# EAGLE design cd32_breakout_1.1a (EAGLE 7.7.0)
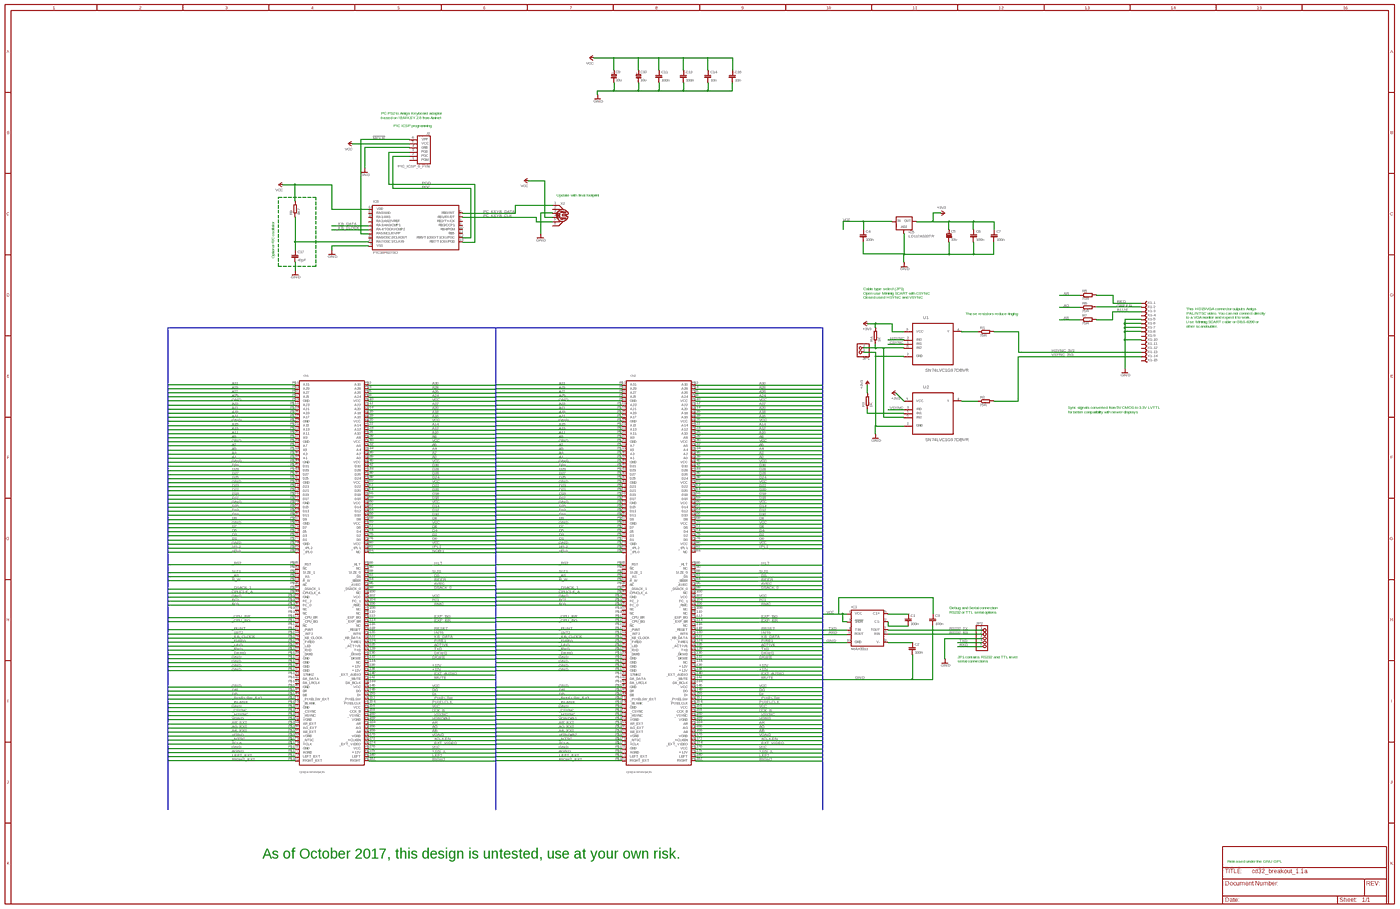
[diagram p0: schematic, sheet 1, overview]
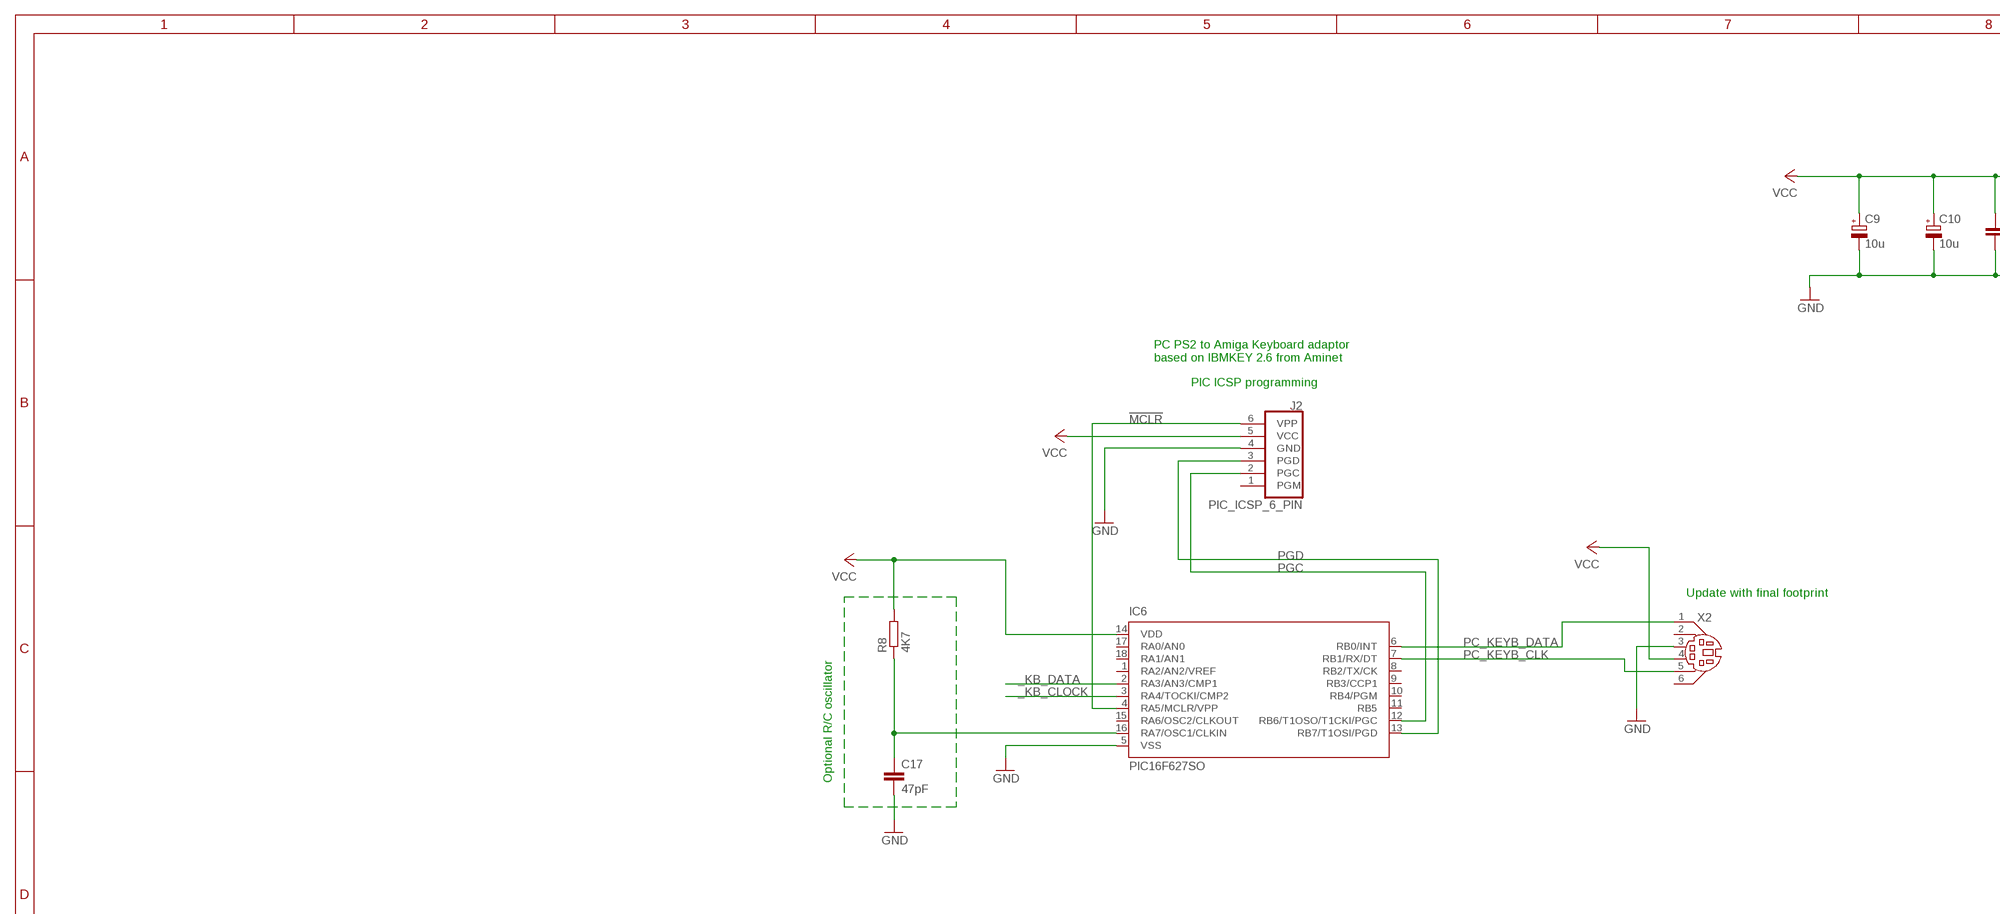
[diagram p1: schematic, sheet 1, part 1 of 4]
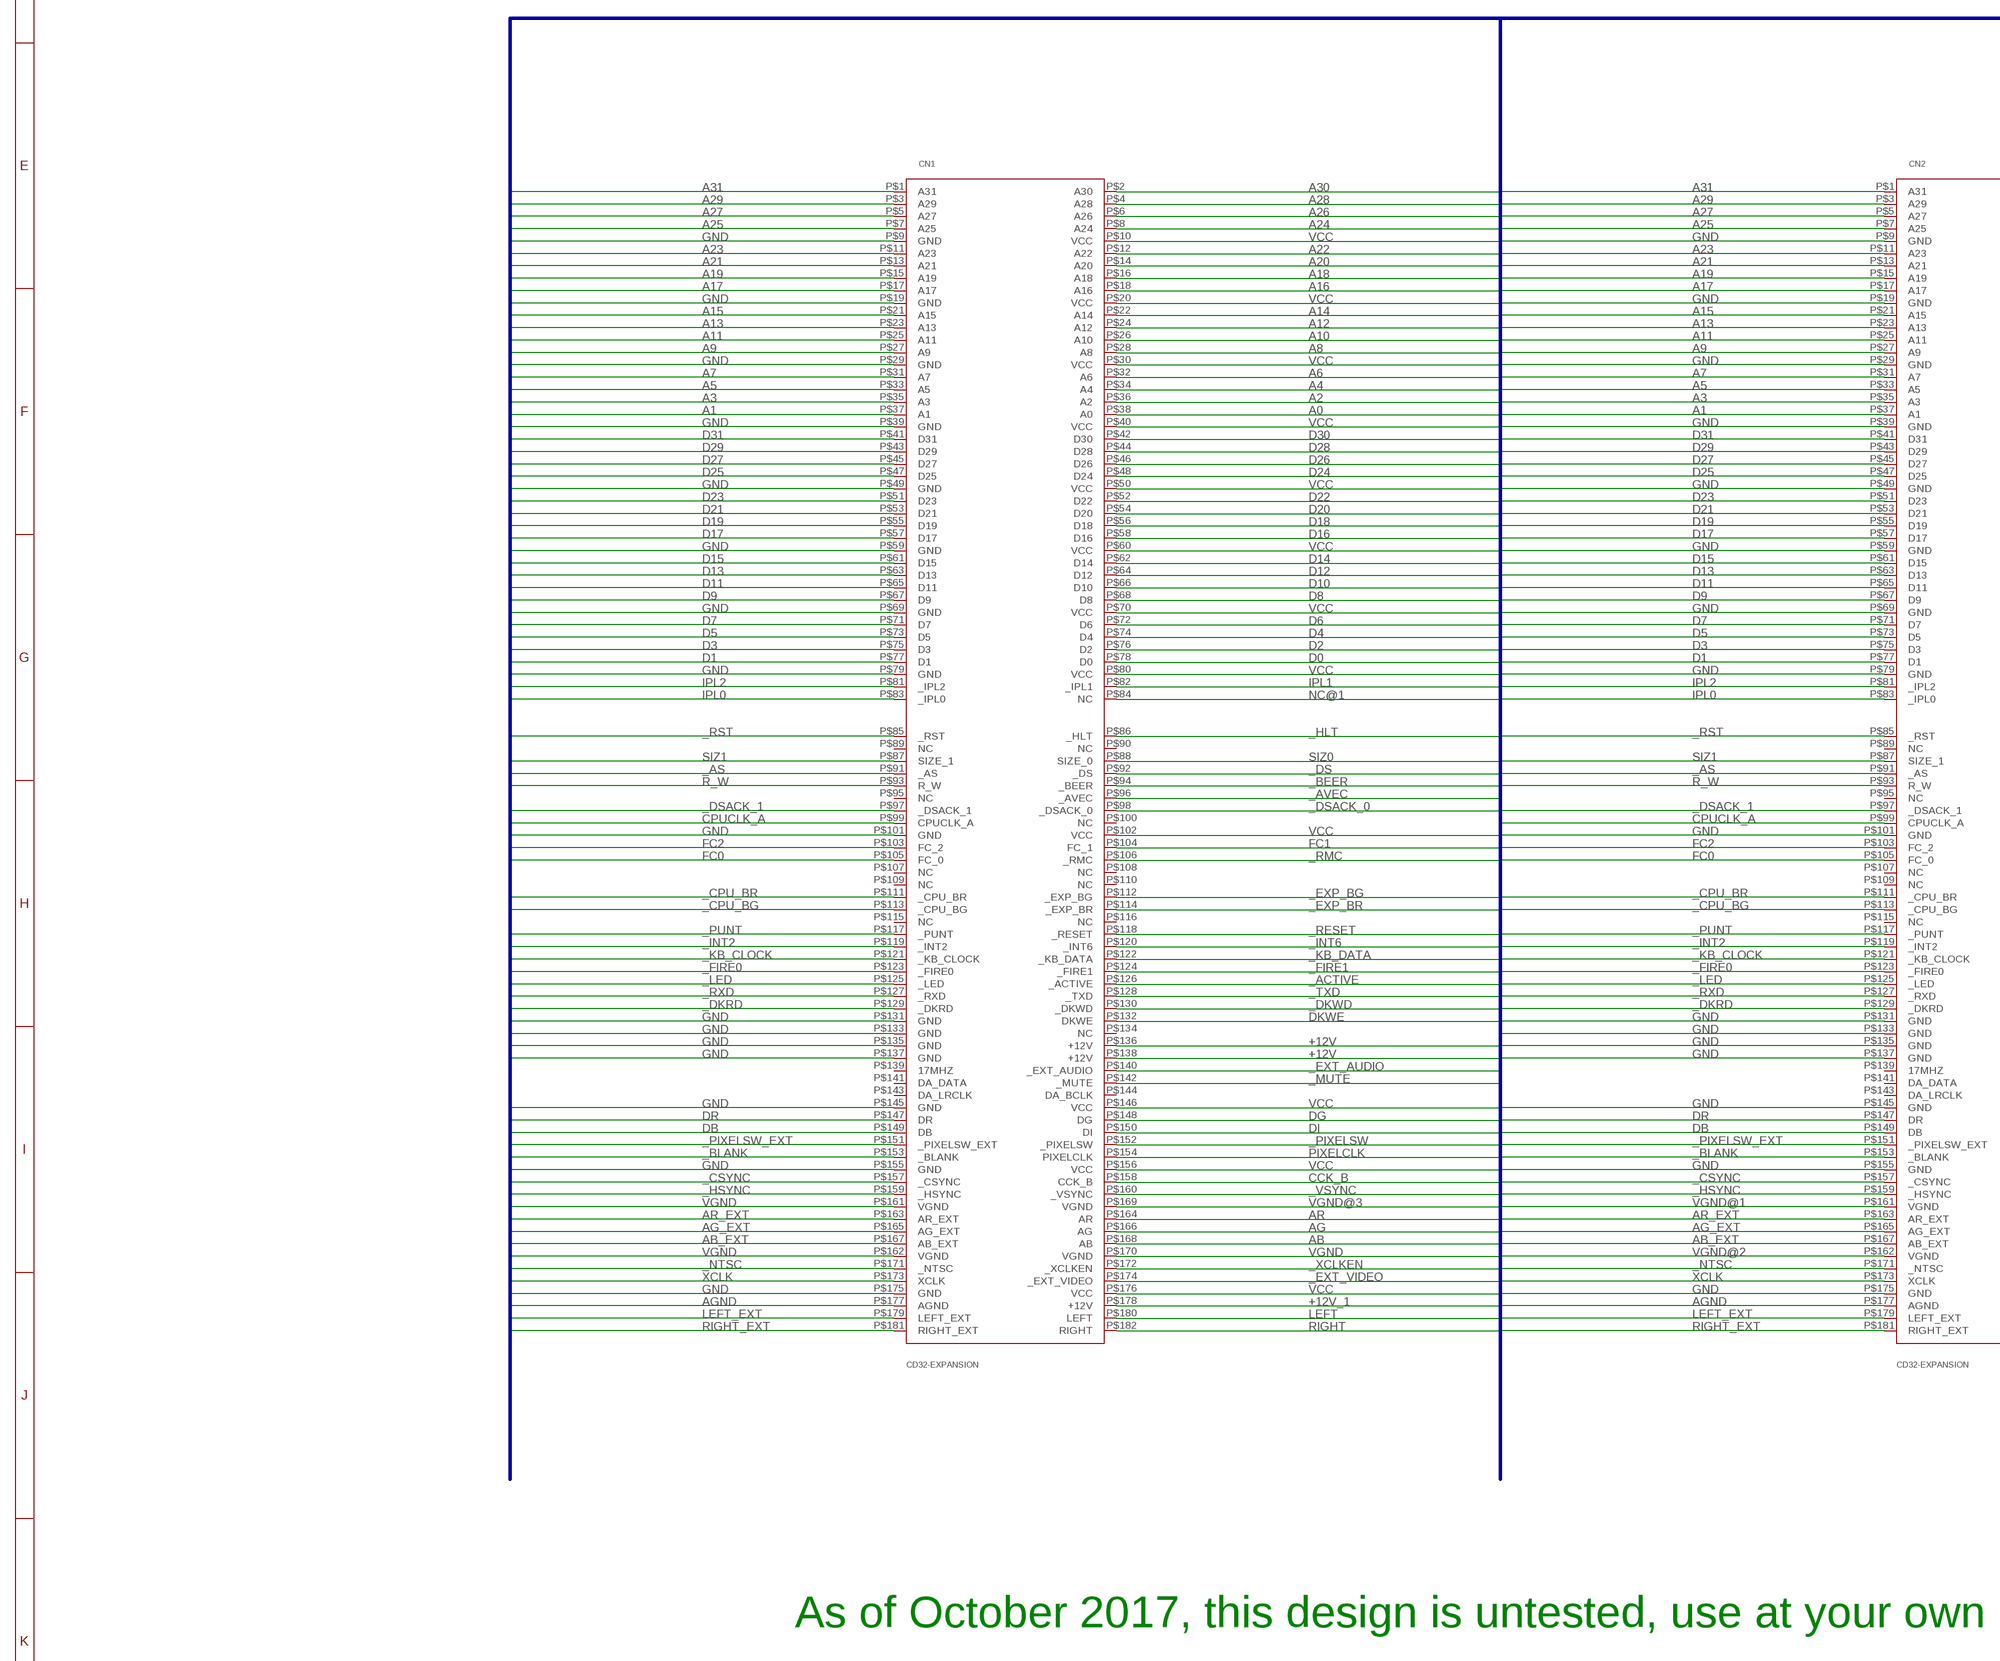
[diagram p2: schematic, sheet 1, part 2 of 4]
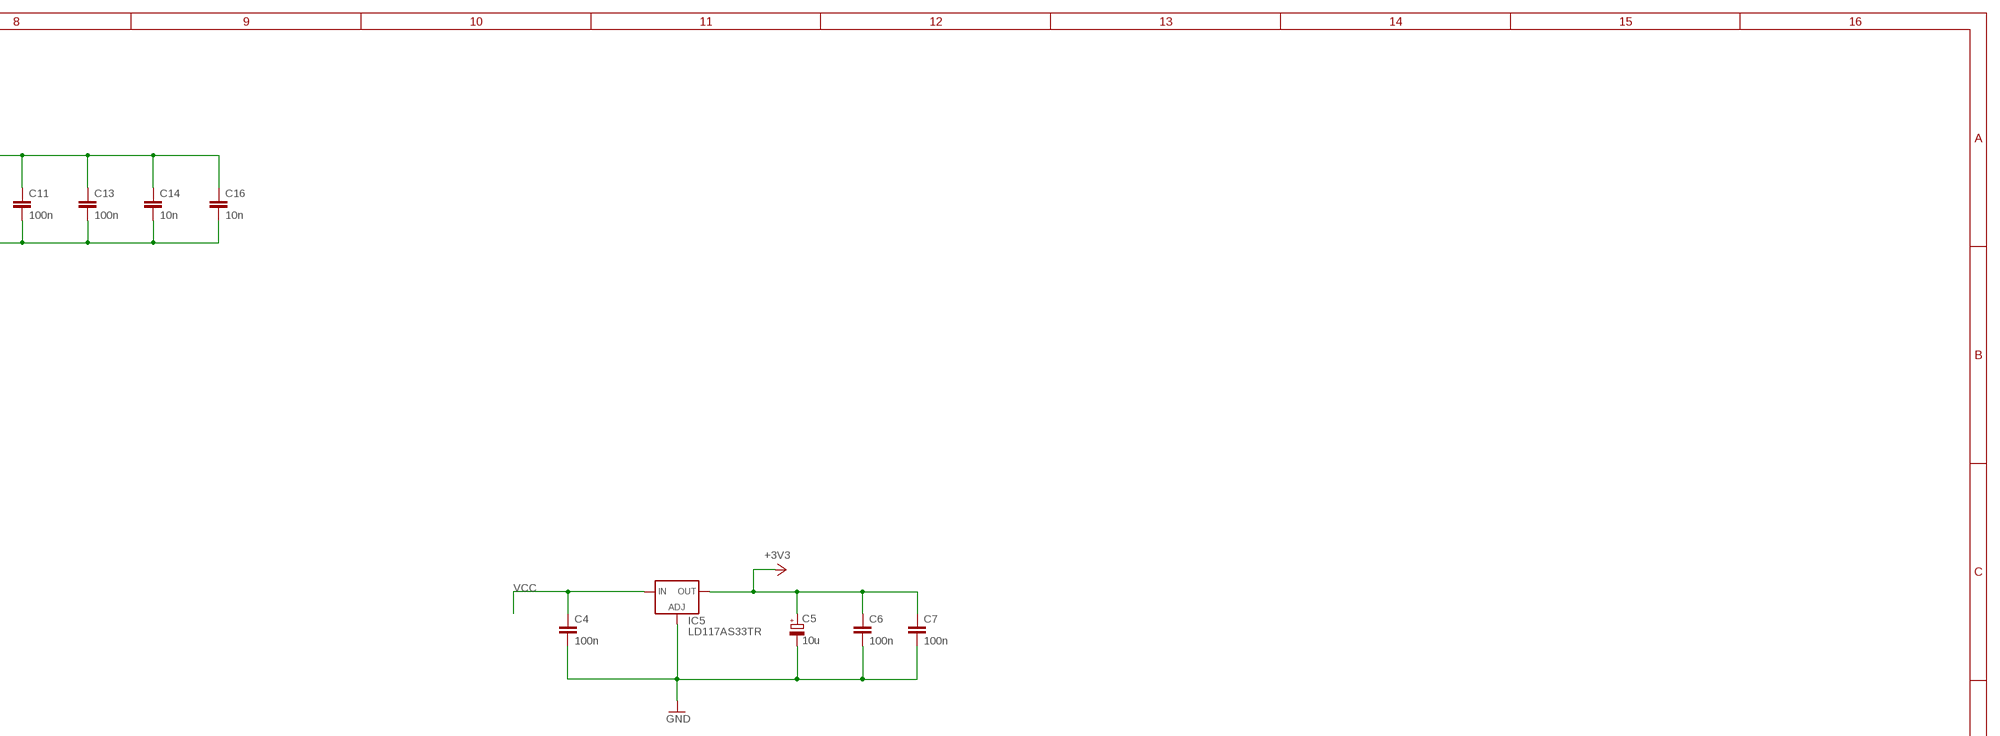
[diagram p3: schematic, sheet 1, part 3 of 4]
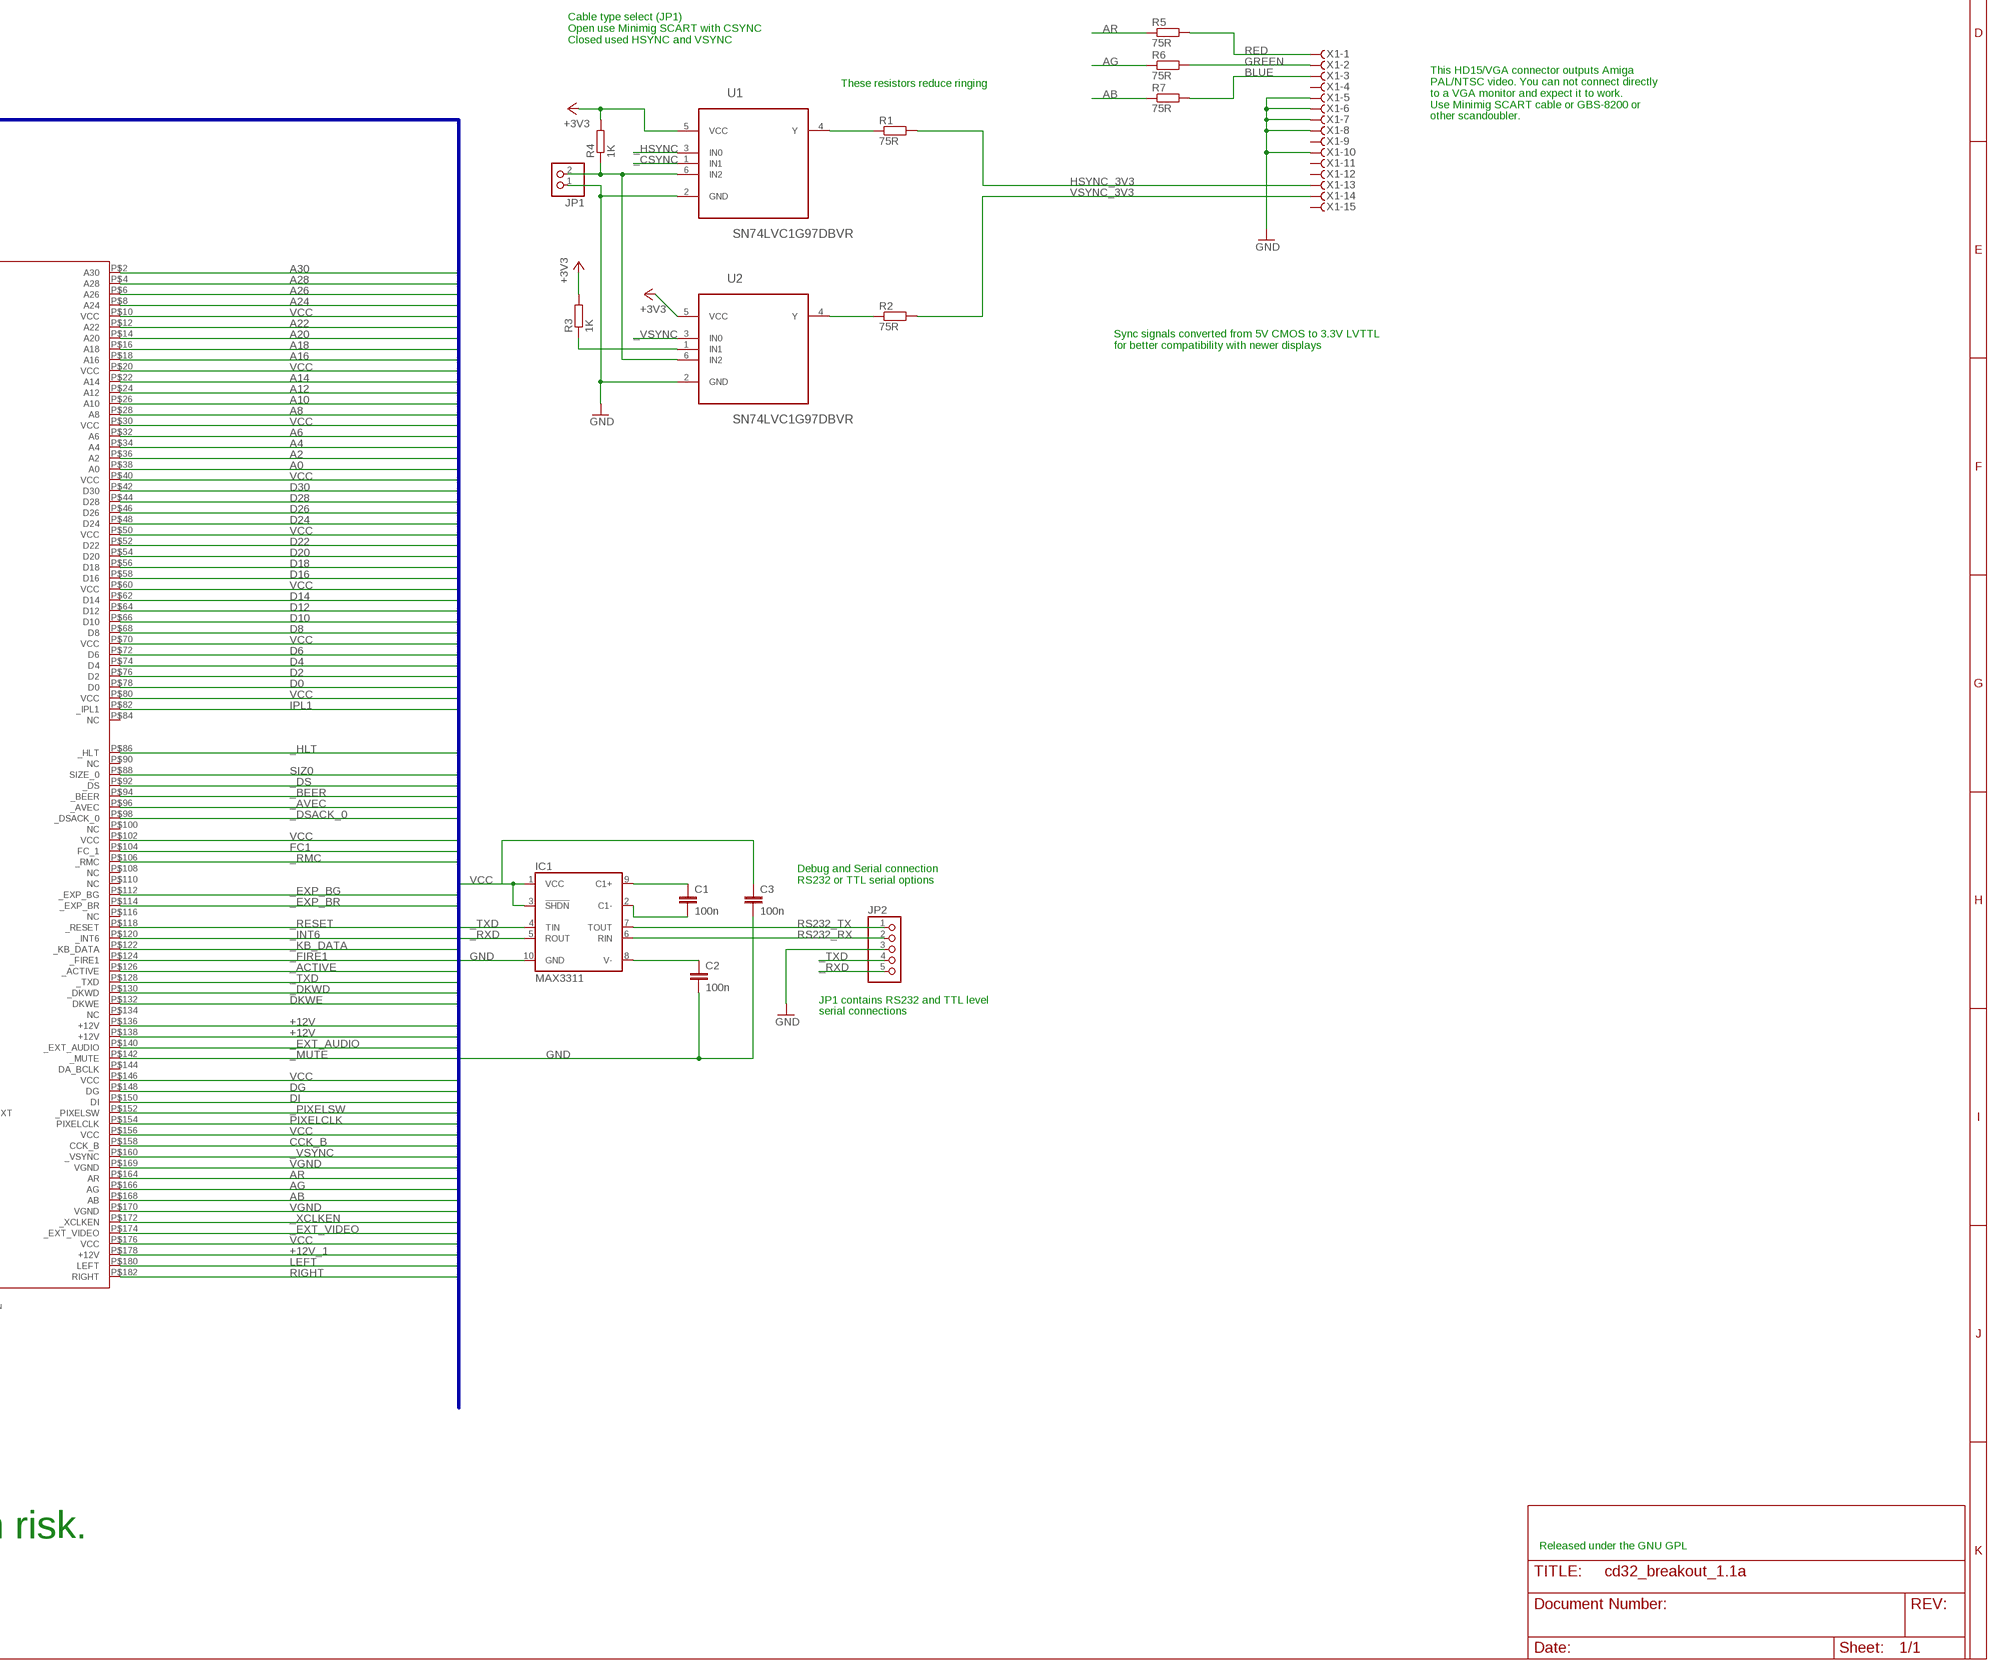
[diagram p4: schematic, sheet 1, part 4 of 4]

## Parts
C1  100n  CC0603  [C0603]
C2  100n  CC0603  [C0603]
C3  100n  CC0603  [C0603]
C4  100n  C-EUC0603  [C0603]
C5  10u  CPOL-EUC  [PANASONIC_C]
C6  100n  C-EUC0603  [C0603]
C7  100n  C-EUC0603  [C0603]
C9  10u  CPOL-EUC  [PANASONIC_C]
C10  10u  CPOL-EUC  [PANASONIC_C]
C11  100n  C-EUC0603  [C0603]
C13  100n  C-EUC0603  [C0603]
C14  10n  C-EUC0603  [C0603]
C16  10n  C-EUC0603  [C0603]
C17  47pF  C-EUC0603  [C0603]
CN1  CD32-EXPANSION  [CD32_EXPANSION_182_MCA]
CN2  CD32-EXPANSION  [CD32_EXPANSION_182_MCA]
IC1  MAX3311  [UMAX10]
IC5  LD117AS33TR  [SOT223]
IC6  PIC16F627SO  [SO-18W]
J2  PIC_ICSP_6_PIN  [MOLEX-1X6]
JP1  PINHD-1X2  [1X02]
JP2  PINHD-1X5  [1X05]
R1  75R  R-EU_R0603  [R0603]
R2  75R  R-EU_R0603  [R0603]
R3  1K  R-EU_R0603  [R0603]
R4  1K  R-EU_R0603  [R0603]
R5  75R  R-EU_R0603  [R0603]
R6  75R  R-EU_R0603  [R0603]
R7  75R  R-EU_R0603  [R0603]
R8  4K7  R-EU_R0603  [R0603]
U1  SN74LVC1G97DBVR  [SOT95P280X145-6N]
U2  SN74LVC1G97DBVR  [SOT95P280X145-6N]
X1  F15HDVS  [HDF15V]
X2  MDIN06K  [MDIN06K]

## Nets
!MCLR: IC6.4(RA5/MCLR/VPP) J2.6(VPP)
+3V3: C5.+ C6.1 C7.1 IC5.4(OUT) R3.2 R4.2 U1.5(VCC) U2.5(VCC)
+12V: CN1.P$136(+12V) CN1.P$138(+12V) CN2.P$136(+12V) CN2.P$138(+12V)
+12V_1: CN1.P$178(+12V) CN2.P$178(+12V)
_ACTIVE: CN1.P$126(_ACTIVE) CN2.P$126(_ACTIVE)
_AS: CN1.P$91(_AS) CN2.P$91(_AS)
_AVEC: CN1.P$96(_AVEC) CN2.P$96(_AVEC)
_BEER: CN1.P$94(_BEER) CN2.P$94(_BEER)
_BLANK: CN1.P$153(_BLANK) CN2.P$153(_BLANK)
_CPU_BG: CN1.P$113(_CPU_BG) CN2.P$113(_CPU_BG)
_CPU_BR: CN1.P$111(_CPU_BR) CN2.P$111(_CPU_BR)
_CSYNC: CN1.P$157(_CSYNC) CN2.P$157(_CSYNC) U1.1(IN1)
_DKRD: CN1.P$129(_DKRD) CN2.P$129(_DKRD)
_DKWD: CN1.P$130(_DKWD) CN2.P$130(_DKWD)
_DS: CN1.P$92(_DS) CN2.P$92(_DS)
_DSACK_0: CN1.P$98(_DSACK_0) CN2.P$98(_DSACK_0)
_DSACK_1: CN1.P$97(_DSACK_1) CN2.P$97(_DSACK_1)
_EXP_BG: CN1.P$112(_EXP_BG) CN2.P$112(_EXP_BG)
_EXP_BR: CN1.P$114(_EXP_BR) CN2.P$114(_EXP_BR)
_EXT_AUDIO: CN1.P$140(_EXT_AUDIO) CN2.P$140(_EXT_AUDIO)
_EXT_VIDEO: CN1.P$174(_EXT_VIDEO) CN2.P$174(_EXT_VIDEO)
_FIRE0: CN1.P$123(_FIRE0) CN2.P$123(_FIRE0)
_FIRE1: CN1.P$124(_FIRE1) CN2.P$124(_FIRE1)
_HLT: CN1.P$86(_HLT) CN2.P$86(_HLT)
_HSYNC: CN1.P$159(_HSYNC) CN2.P$159(_HSYNC) U1.3(IN0)
_INT2: CN1.P$119(_INT2) CN2.P$119(_INT2)
_INT6: CN1.P$120(_INT6) CN2.P$120(_INT6)
_KB_CLOCK: CN1.P$121(_KB_CLOCK) CN2.P$121(_KB_CLOCK) IC6.3(RA4/TOCKI/CMP2)
_KB_DATA: CN1.P$122(_KB_DATA) CN2.P$122(_KB_DATA) IC6.2(RA3/AN3/CMP1)
_LED: CN1.P$125(_LED) CN2.P$125(_LED)
_MUTE: CN1.P$142(_MUTE) CN2.P$142(_MUTE)
_NTSC: CN1.P$171(_NTSC) CN2.P$171(_NTSC)
_PIXELSW: CN1.P$152(_PIXELSW) CN2.P$152(_PIXELSW)
_PIXELSW_EXT: CN1.P$151(_PIXELSW_EXT) CN2.P$151(_PIXELSW_EXT)
_PUNT: CN1.P$117(_PUNT) CN2.P$117(_PUNT)
_RESET: CN1.P$118(_RESET) CN2.P$118(_RESET)
_RMC: CN1.P$106(_RMC) CN2.P$106(_RMC)
_RST: CN1.P$85(_RST) CN2.P$85(_RST)
_RXD: CN1.P$127(_RXD) CN2.P$127(_RXD) IC1.5(ROUT) JP2.5
_TXD: CN1.P$128(_TXD) CN2.P$128(_TXD) IC1.4(TIN) JP2.4
_VSYNC: CN1.P$160(_VSYNC) CN2.P$160(_VSYNC) U2.3(IN0)
_XCLKEN: CN1.P$172(_XCLKEN) CN2.P$172(_XCLKEN)
A0: CN1.P$38(A0) CN2.P$38(A0)
A1: CN1.P$37(A1) CN2.P$37(A1)
A2: CN1.P$36(A2) CN2.P$36(A2)
A3: CN1.P$35(A3) CN2.P$35(A3)
A4: CN1.P$34(A4) CN2.P$34(A4)
A5: CN1.P$33(A5) CN2.P$33(A5)
A6: CN1.P$32(A6) CN2.P$32(A6)
A7: CN1.P$31(A7) CN2.P$31(A7)
A8: CN1.P$28(A8) CN2.P$28(A8)
A9: CN1.P$27(A9) CN2.P$27(A9)
A10: CN1.P$26(A10) CN2.P$26(A10)
A11: CN1.P$25(A11) CN2.P$25(A11)
A12: CN1.P$24(A12) CN2.P$24(A12)
A13: CN1.P$23(A13) CN2.P$23(A13)
A14: CN1.P$22(A14) CN2.P$22(A14)
A15: CN1.P$21(A15) CN2.P$21(A15)
A16: CN1.P$18(A16) CN2.P$18(A16)
A17: CN1.P$17(A17) CN2.P$17(A17)
A18: CN1.P$16(A18) CN2.P$16(A18)
A19: CN1.P$15(A19) CN2.P$15(A19)
A20: CN1.P$14(A20) CN2.P$14(A20)
A21: CN1.P$13(A21) CN2.P$13(A21)
A22: CN1.P$12(A22) CN2.P$12(A22)
A23: CN1.P$11(A23) CN2.P$11(A23)
A24: CN1.P$8(A24) CN2.P$8(A24)
A25: CN1.P$7(A25) CN2.P$7(A25)
A26: CN1.P$6(A26) CN2.P$6(A26)
A27: CN1.P$5(A27) CN2.P$5(A27)
A28: CN1.P$4(A28) CN2.P$4(A28)
A29: CN1.P$3(A29) CN2.P$3(A29)
A30: CN1.P$2(A30) CN2.P$2(A30)
A31: CN1.P$1(A31) CN2.P$1(A31)
AB: CN1.P$168(AB) CN2.P$168(AB) R7.1
AB_EXT: CN1.P$167(AB_EXT) CN2.P$167(AB_EXT)
AG: CN1.P$166(AG) CN2.P$166(AG) R6.1
AG_EXT: CN1.P$165(AG_EXT) CN2.P$165(AG_EXT)
AGND: CN1.P$177(AGND) CN2.P$177(AGND)
AR: CN1.P$164(AR) CN2.P$164(AR) R5.1
AR_EXT: CN1.P$163(AR_EXT) CN2.P$163(AR_EXT)
BLUE: R7.2 X1.3
CCK_B: CN1.P$158(CCK_B) CN2.P$158(CCK_B)
CPUCLK_A: CN1.P$99(CPUCLK_A) CN2.P$99(CPUCLK_A)
D0: CN1.P$78(D0) CN2.P$78(D0)
D1: CN1.P$77(D1) CN2.P$77(D1)
D2: CN1.P$76(D2) CN2.P$76(D2)
D3: CN1.P$75(D3) CN2.P$75(D3)
D4: CN1.P$74(D4) CN2.P$74(D4)
D5: CN1.P$73(D5) CN2.P$73(D5)
D6: CN1.P$72(D6) CN2.P$72(D6)
D7: CN1.P$71(D7) CN2.P$71(D7)
D8: CN1.P$68(D8) CN2.P$68(D8)
D9: CN1.P$67(D9) CN2.P$67(D9)
D10: CN1.P$66(D10) CN2.P$66(D10)
D11: CN1.P$65(D11) CN2.P$65(D11)
D12: CN1.P$64(D12) CN2.P$64(D12)
D13: CN1.P$63(D13) CN2.P$63(D13)
D14: CN1.P$62(D14) CN2.P$62(D14)
D15: CN1.P$61(D15) CN2.P$61(D15)
D16: CN1.P$58(D16) CN2.P$58(D16)
D17: CN1.P$57(D17) CN2.P$57(D17)
D18: CN1.P$56(D18) CN2.P$56(D18)
D19: CN1.P$55(D19) CN2.P$55(D19)
D20: CN1.P$54(D20) CN2.P$54(D20)
D21: CN1.P$53(D21) CN2.P$53(D21)
D22: CN1.P$52(D22) CN2.P$52(D22)
D23: CN1.P$51(D23) CN2.P$51(D23)
D24: CN1.P$48(D24) CN2.P$48(D24)
D25: CN1.P$47(D25) CN2.P$47(D25)
D26: CN1.P$46(D26) CN2.P$46(D26)
D27: CN1.P$45(D27) CN2.P$45(D27)
D28: CN1.P$44(D28) CN2.P$44(D28)
D29: CN1.P$43(D29) CN2.P$43(D29)
D30: CN1.P$42(D30) CN2.P$42(D30)
D31: CN1.P$41(D31) CN2.P$41(D31)
DB: CN1.P$149(DB) CN2.P$149(DB)
DG: CN1.P$148(DG) CN2.P$148(DG)
DI: CN1.P$150(DI) CN2.P$150(DI)
DKWE: CN1.P$132(DKWE) CN2.P$132(DKWE)
DR: CN1.P$147(DR) CN2.P$147(DR)
FC0: CN1.P$105(FC_0) CN2.P$105(FC_0)
FC1: CN1.P$104(FC_1) CN2.P$104(FC_1)
FC2: CN1.P$103(FC_2) CN2.P$103(FC_2)
GND: C2.2 C3.2 C4.2 C5.- C6.2 C7.2 C9.- C10.- C11.2 C13.2 C14.2 C16.2 C17.2 CN1.P$9(GND) CN1.P$19(GND) CN1.P$29(GND) CN1.P$39(GND) CN1.P$49(GND) CN1.P$59(GND) CN1.P$69(GND) CN1.P$79(GND) CN1.P$101(GND) CN1.P$131(GND) CN1.P$133(GND) CN1.P$135(GND) CN1.P$137(GND) CN1.P$145(GND) CN1.P$155(GND) CN1.P$175(GND) CN2.P$9(GND) CN2.P$19(GND) CN2.P$29(GND) CN2.P$39(GND) CN2.P$49(GND) CN2.P$59(GND) CN2.P$69(GND) CN2.P$79(GND) CN2.P$101(GND) CN2.P$131(GND) CN2.P$133(GND) CN2.P$135(GND) CN2.P$137(GND) CN2.P$145(GND) CN2.P$155(GND) CN2.P$175(GND) IC1.10(GND) IC5.1(ADJ) IC6.5(VSS) J2.4(GND) JP1.1 JP2.3 U1.2(GND) U2.2(GND) X1.5 X1.6 X1.7 X1.8 X1.10 X2.3
GREEN: R6.2 X1.2
HSYNC_3V3: R1.2 X1.13
IPL0: CN1.P$83(_IPL0) CN2.P$83(_IPL0)
IPL1: CN1.P$82(_IPL1) CN2.P$82(_IPL1)
IPL2: CN1.P$81(_IPL2) CN2.P$81(_IPL2)
LEFT: CN1.P$180(LEFT) CN2.P$180(LEFT)
LEFT_EXT: CN1.P$179(LEFT_EXT) CN2.P$179(LEFT_EXT)
N$1: C1.1 IC1.9(C1+)
N$2: C1.2 IC1.2(C1-)
N$3: C2.1 IC1.8(V-)
N$6: R3.1 U2.1(IN1)
N$7: JP1.2 R4.1 U1.6(IN2) U2.6(IN2)
N$8: R1.1 U1.4(Y)
N$9: R2.1 U2.4(Y)
N$10: C17.1 IC6.16(RA7/OSC1/CLKIN) R8.1
NC@1: CN1.P$84(NC)
PC_KEYB_CLK: IC6.7(RB1/RX/DT) X2.5
PC_KEYB_DATA: IC6.6(RB0/INT) X2.1
PGC: IC6.12(RB6/T1OSO/T1CKI/PGC) J2.2(PGC)
PGD: IC6.13(RB7/T1OSI/PGD) J2.3(PGD)
PIXELCLK: CN1.P$154(PIXELCLK) CN2.P$154(PIXELCLK)
R_W: CN1.P$93(R_W) CN2.P$93(R_W)
RED: R5.2 X1.1
RIGHT: CN1.P$182(RIGHT) CN2.P$182(RIGHT)
RIGHT_EXT: CN1.P$181(RIGHT_EXT) CN2.P$181(RIGHT_EXT)
RS232_RX: IC1.6(RIN) JP2.2
RS232_TX: IC1.7(TOUT) JP2.1
SIZ0: CN1.P$88(SIZE_0) CN2.P$88(SIZE_0)
SIZ1: CN1.P$87(SIZE_1) CN2.P$87(SIZE_1)
VCC: C3.1 C4.1 C9.+ C10.+ C11.1 C13.1 C14.1 C16.1 CN1.P$10(VCC) CN1.P$20(VCC) CN1.P$30(VCC) CN1.P$40(VCC) CN1.P$50(VCC) CN1.P$60(VCC) CN1.P$70(VCC) CN1.P$80(VCC) CN1.P$102(VCC) CN1.P$146(VCC) CN1.P$156(VCC) CN1.P$176(VCC) CN2.P$10(VCC) CN2.P$20(VCC) CN2.P$30(VCC) CN2.P$40(VCC) CN2.P$50(VCC) CN2.P$60(VCC) CN2.P$70(VCC) CN2.P$80(VCC) CN2.P$102(VCC) CN2.P$146(VCC) CN2.P$156(VCC) CN2.P$176(VCC) IC1.1(VCC) IC1.3(!SHDN) IC5.3(IN) IC6.14(VDD) J2.5(VCC) R8.2 X2.4
VGND: CN1.P$161(VGND) CN1.P$162(VGND) CN1.P$170(VGND) CN2.P$169(VGND) CN2.P$170(VGND)
VGND@1: CN2.P$161(VGND)
VGND@2: CN2.P$162(VGND)
VGND@3: CN1.P$169(VGND)
VSYNC_3V3: R2.2 X1.14
XCLK: CN1.P$173(XCLK) CN2.P$173(XCLK)
Unconnected: CN1.P$89(NC) CN1.P$90(NC) CN1.P$95(NC) CN1.P$100(NC) CN1.P$107(NC) CN1.P$108(NC) CN1.P$109(NC) CN1.P$110(NC) CN1.P$115(NC) CN1.P$116(NC) CN1.P$134(NC) CN1.P$139(17MHZ) CN1.P$141(DA_DATA) CN1.P$143(DA_LRCLK) CN1.P$144(DA_BCLK) CN2.P$84(NC) CN2.P$89(NC) CN2.P$90(NC) CN2.P$95(NC) CN2.P$100(NC) CN2.P$107(NC) CN2.P$108(NC) CN2.P$109(NC) CN2.P$110(NC) CN2.P$115(NC) CN2.P$116(NC) CN2.P$134(NC) CN2.P$139(17MHZ) CN2.P$141(DA_DATA) CN2.P$143(DA_LRCLK) CN2.P$144(DA_BCLK) IC6.1(RA2/AN2/VREF) IC6.8(RB2/TX/CK) IC6.9(RB3/CCP1) IC6.10(RB4/PGM) IC6.11(RB5) IC6.15(RA6/OSC2/CLKOUT) IC6.17(RA0/AN0) IC6.18(RA1/AN1) J2.1(PGM) X1.4 X1.9 X1.11 X1.12 X1.15 X2.2 X2.6

## Buses
A[0..31],AB,AB_EXT,_ACTIVE,AG,AG_EXT,AGND,AR,AR_EXT,_AS,_AVEC,_BEER,_BLANK,CCK_B,CLK_17MHZ,_CPU_BG,_CPU_BR,CPUCLK_A,_CSYNC,D[0..31],DA_BCLK,DA_DATA,DA_LRCLK,DB,DG,DI,_DKRD,_DKWD,DKWE,DR,_DS,_DSACK_0,_DSACK_1,_EXP_BG,_EXP_BR,_EXT_AUDIO,_EXT_VIDEO,FC[0..2],_FIRE0,_FIRE1,GND,_HLT,_HSYNC,_INT2,_INT6,_IPL[0..2],_KB_CLOCK,_KB_DATA,_LED,LEFT,LEFT_EXT,_MUTE,NC,_NTSC,PIXELCLK,_PIXELSW,_PIXELSW_EXT,_PUNT,_RESET,RIGHT,RIGHT_EXT,_RMC,_RST,R_W,_RXD,SIZE[0..1],_TXD,VCC,VCC12V,VGND,_VSYNC,XCLK,_XCLKEN

## Notes on the sheet
- PC PS2 to Amiga Keyboard adaptor
  based on IBMKEY 2.6 from Aminet
- PIC ICSP programming
- Update with final footprint
- Optional R/C oscillator
- Cable type select (JP1)
  Open use Minimig SCART with CSYNC
  Closed used HSYNC and VSYNC
- These resistors reduce ringing
- This HD15/VGA connector outputs Amiga
  PAL/NTSC video. You can not connect directly
  to a VGA monitor and expect it to work.
  Use Minimig SCART cable or GBS-8200 or
  other scandoubler.
- Sync signals converted from 5V CMOS to 3.3V LVTTL
  for better compatibility with newer displays
- Debug and Serial connection
  RS232 or TTL serial options
- JP1 contains RS232 and TTL level
- serial connections
- As of October 2017, this design is untested, use at your own risk.
- Released under the GNU GPL

## Library data of the parts
C1-C3 = eagle-ltspice:C: CAPACITOR, European symbol; SPICEMODEL: NONE; SPICEPREFIX: C
C4 C6 C7 C11 C13 C14 C16 C17 = rcl:C-EU: CAPACITOR, European symbol
C5 C9 C10 = rcl:CPOL-EU: POLARIZED CAPACITOR, European symbol
CN1 CN2 = Amiga:CD32-EXPANSION
IC1 = maxim:MAX3311: 460kbps, 1µA Supply Current, RS-232-Compatible Transceivers in µMAX Source: http://www.maxim-ic.com .. MAX3311-MAX3313.pdf; MF: MAXIM; MPN: MAX3311ECUB+; OC_FARNELL: 1379937; OC_NEWARK: 67K4953
IC5 = v-reg:LD117A?*: Low drop fixed and adjustable positive voltage regulators 1 A Source: http://www.st.com/stonline/products/literature/ds/7194/ld1117axx.pdf
IC6 = microchip:PIC16F62*: FLASH-Based 8-Bit CMOS Microcontroller Source: http://ww1.microchip.com/downloads/en/DeviceDoc/40300C.pdf; MF: MICROCHIP; MPN: PIC16F627-04I/SO; OC_FARNELL: 9760296; OC_NEWARK: 19C7271
J2 = SparkFun-Connectors:PIC_ICSP_6_PIN: ISCP Programming connector for PICs This 6 pin header contains all the lines necessary for programming most PIC microcontrollers. Here is the connector we sell at SparkFun: Polarized Connectors - Header (6-Pin) <https://www.sparkfun.com/products/8094> (PRT-08094) It is used on this SparkFun product: SparkFun UDB5 - PIC UAV Development Board <https://www.sparkfun.com/products/11703> (DEV-11703) Also, if you need a nice PIC programmer, please check these out: MPLAB PICkit 3 <https://www.sparkfun.com/products/9973> (PGM-09973); PROD_ID: CONN-08046; SF_ID: PRT-08094
JP1 = pinhead:PINHD-1X2: PIN HEADER
JP2 = pinhead:PINHD-1X5: PIN HEADER
R1-R8 = rcl:R-EU_: RESISTOR, European symbol
U1 U2 = 74LVC1G97:SN74LVC1G97DBVR: CONFIGURABLE MULTIPLE-FUNCTION GATE; MPN: SN74LVC1G97DBVR; OC_FARNELL: 1470837; OC_NEWARK: 32H6375; PACKAGE: SOT-23-6; SUPPLIER: Texas Instruments
X1 = con-subd:F15?S: SUB-D; OC_FARNELL: unknown; OC_NEWARK: unknown
X2 = con-yamaichi:MDIN06K: YAMAICHI CONNECTOR; OC_FARNELL: unknown; OC_NEWARK: unknown

## Board
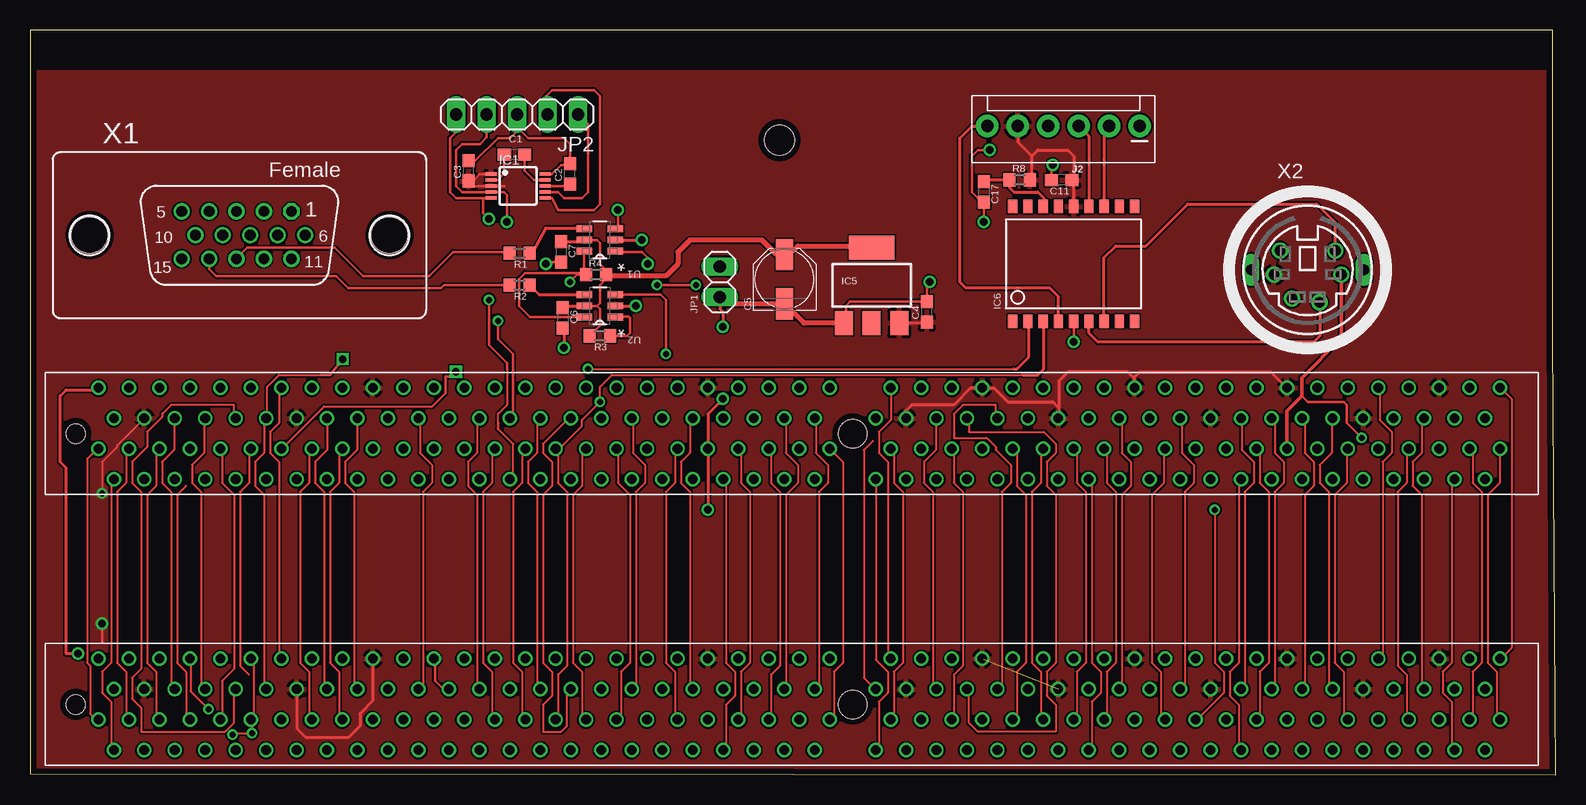
[diagram p5: board, top side]
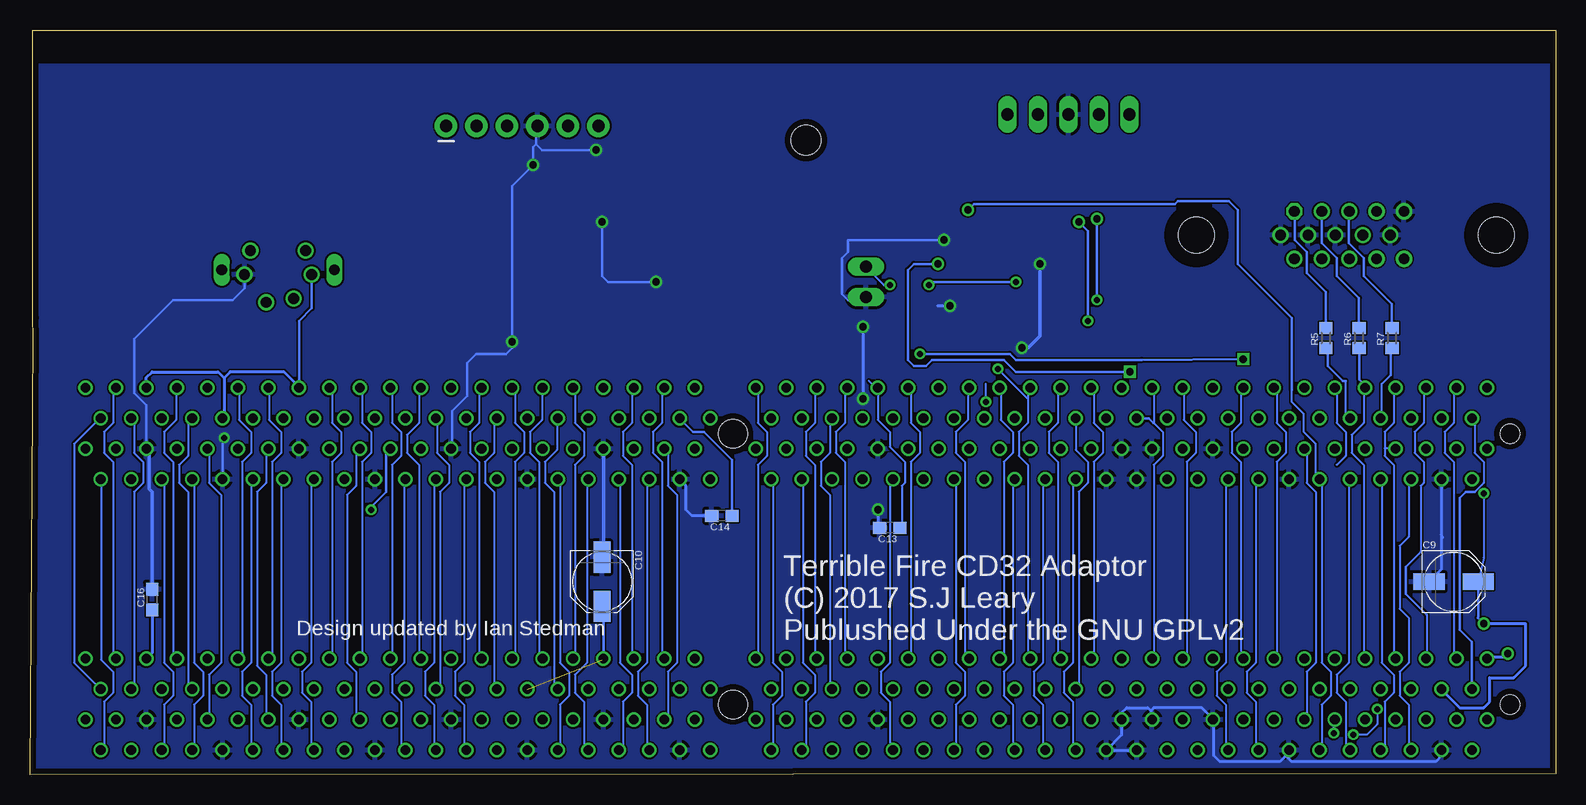
[diagram p6: board, bottom side, seen from below]

Size 127.18 x 62.1 mm. Coordinates in mm from the lower left corner, seen from the top.
Outline: 0,0.1 127.18,0 126.93,36.5 126.95,38.1 126.95,62.1 0,62.1 0,0.1
Copper layers (1*16): Top 0.035mm / dielectric 1.5mm / Bottom 0.035mm
Design rules "pcbtrainsmt": minimum track width 0.15mm, minimum drill 0.5mm, track to track 0.15mm, track to pad 0.15mm, pad to pad 0.15mm, via to via 0.15mm, smd to smd 0.15mm, copper to edge 0.5mm, drill to drill 0.5mm, minimum pad ring 5mil, minimum via ring 8mil, stop-mask expansion 0mil, vias tented up to drill 0mil, thermal gap 10mil
Holes 2.5 mm at 62.49,52.92

### Footprints (pad centres in the part's own frame; a part is rotated, then mirrored left to right if it is on the bottom)
C0603 = smd 1.1 x 1: 1 -0.85,0; 2 0.85,0
PANASONIC_C = smd 2.6 x 1.4: + 2.05,0; - -2.05,0
CD32_EXPANSION_182_MCA = drill 0.8: P$1 59.055,-1.27; P$2 59.055,3.81; P$3 57.785,-3.81; P$4 57.785,1.27; P$5 56.515,-1.27; P$6 56.515,3.81; P$7 55.245,-3.81; P$8 55.245,1.27; P$9 53.975,-1.27; P$10 53.975,3.81; P$11 52.705,-3.81; P$12 52.705,1.27; P$13 51.435,-1.27; P$14 51.435,3.81; P$15 50.165,-3.81; P$16 50.165,1.27; P$17 48.895,-1.27; P$18 48.895,3.81; P$19 47.625,-3.81; P$20 47.625,1.27; P$21 46.355,-1.27; P$22 46.355,3.81; P$23 45.085,-3.81; P$24 45.085,1.27; P$25 43.815,-1.27; P$26 43.815,3.81; P$27 42.545,-3.81; P$28 42.545,1.27; P$29 41.275,-1.27; P$30 41.275,3.81; P$31 40.005,-3.81; P$32 40.005,1.27; P$33 38.735,-1.27; P$34 38.735,3.81; P$35 37.465,-3.81; P$36 37.465,1.27; P$37 36.195,-1.27; P$38 36.195,3.81; P$39 34.925,-3.81; P$40 34.925,1.27; P$41 33.655,-1.27; P$42 33.655,3.81; P$43 32.385,-3.81; P$44 32.385,1.27; P$45 31.115,-1.27; P$46 31.115,3.81; P$47 29.845,-3.81; P$48 29.845,1.27; P$49 28.575,-1.27; P$50 28.575,3.81; P$51 27.305,-3.81; P$52 27.305,1.27; P$53 26.035,-1.27; P$54 26.035,3.81; P$55 24.765,-3.81; P$56 24.765,1.27; P$57 23.495,-1.27; P$58 23.495,3.81; P$59 22.225,-3.81; P$60 22.225,1.27; P$61 20.955,-1.27; P$62 20.955,3.81; P$63 19.685,-3.81; P$64 19.685,1.27; P$65 18.415,-1.27; P$66 18.415,3.81; P$67 17.145,-3.81; P$68 17.145,1.27; P$69 15.875,-1.27; P$70 15.875,3.81; P$71 14.605,-3.81; P$72 14.605,1.27; P$73 13.335,-1.27; P$74 13.335,3.81; P$75 12.065,-3.81; P$76 12.065,1.27; P$77 10.795,-1.27; P$78 10.795,3.81; P$79 9.525,-3.81; P$80 9.525,1.27; P$81 8.255,-1.27; P$82 8.255,3.81; P$83 6.985,-3.81; P$84 6.985,1.27; P$85 3.175,-1.27; P$86 3.175,3.81; P$87 1.905,-3.81; P$88 1.905,1.27; P$89 0.635,-1.27; P$90 0.635,3.81; P$91 -0.635,-3.81; P$92 -0.635,1.27; P$93 -1.905,-1.27; P$94 -1.905,3.81; P$95 -3.175,-3.81; P$96 -3.175,1.27; P$97 -4.445,-1.27; P$98 -4.445,3.81; P$99 -5.715,-3.81; P$100 -5.715,1.27; P$101 -6.985,-1.27; P$102 -6.985,3.81; P$103 -8.255,-3.81; P$104 -8.255,1.27; P$105 -9.525,-1.27; P$106 -9.525,3.81; P$107 -10.795,-3.81; P$108 -10.795,1.27; P$109 -12.065,-1.27; P$110 -12.065,3.81; P$111 -13.335,-3.81; P$112 -13.335,1.27; P$113 -14.605,-1.27; P$114 -14.605,3.81; P$115 -15.875,-3.81; P$116 -15.875,1.27; P$117 -17.145,-1.27; P$118 -17.145,3.81; P$119 -18.415,-3.81; P$120 -18.415,1.27; P$121 -19.685,-1.27; P$122 -19.685,3.81; P$123 -20.955,-3.81; P$124 -20.955,1.27; P$125 -22.225,-1.27; P$126 -22.225,3.81; P$127 -23.495,-3.81; P$128 -23.495,1.27; P$129 -24.765,-1.27; P$130 -24.765,3.81; P$131 -26.035,-3.81; P$132 -26.035,1.27; P$133 -27.305,-1.27; P$134 -27.305,3.81; P$135 -28.575,-3.81; P$136 -28.575,1.27; P$137 -29.845,-1.27; P$138 -29.845,3.81; P$139 -31.115,-3.81; P$140 -31.115,1.27; P$141 -32.385,-1.27; P$142 -32.385,3.81; P$143 -33.655,-3.81; P$144 -33.655,1.27; P$145 -34.925,-1.27; P$146 -34.925,3.81; P$147 -36.195,-3.81; P$148 -36.195,1.27; P$149 -37.465,-1.27; P$150 -37.465,3.81; P$151 -38.735,-3.81; P$152 -38.735,1.27; P$153 -40.005,-1.27; P$154 -40.005,3.81; P$155 -41.275,-3.81; P$156 -41.275,1.27; P$157 -42.545,-1.27; P$158 -42.545,3.81; P$159 -43.815,-3.81; P$160 -43.815,1.27; P$161 -45.085,-1.27; P$162 -45.085,3.81; P$163 -46.355,-3.81; P$164 -46.355,1.27; P$165 -47.625,-1.27; P$166 -47.625,3.81; P$167 -48.895,-3.81; P$168 -48.895,1.27; P$169 -50.165,-1.27; P$170 -50.165,3.81; P$171 -51.435,-3.81; P$172 -51.435,1.27; P$173 -52.705,-1.27; P$174 -52.705,3.81; P$175 -53.975,-3.81; P$176 -53.975,1.27; P$177 -55.245,-1.27; P$178 -55.245,3.81; P$179 -56.515,-3.81; P$180 -56.515,1.27; P$181 -57.785,-1.27; P$182 -57.785,3.81 | hole 2.362: 5.08,0 | hole 1.6: -59.69,0
UMAX10 = smd 0.32 x 0.9: 1 -1,-2.25; 2 -0.5,-2.25; 3 0,-2.25; 4 0.5,-2.25; 5 1,-2.25; 6 1,2.25; 7 0.5,2.25; 8 0,2.25; 9 -0.5,2.25; 10 -1,2.25
SOT223 = smd 1.5 x 2: 1 -2.3,-3.15; 2 0,-3.15; 3 2.3,-3.15 | smd 3.8 x 2: 4 0,3.15
SO-18W = smd 0.762 x 1.143: 1 -5.08,-4.788; 2 -3.81,-4.788; 3 -2.54,-4.788; 4 -1.27,-4.788; 5 0,-4.788; 6 1.27,-4.788; 7 2.54,-4.788; 8 3.81,-4.788; 9 5.08,-4.788; 10 5.08,4.788; 11 3.81,4.788; 12 2.54,4.788; 13 1.27,4.788; 14 0,4.788; 15 -1.27,4.788; 16 -2.54,4.788; 17 -3.81,4.788; 18 -5.08,4.788
MOLEX-1X6 = drill 1.016 pad 1.88: 1 0,0; 2 2.54,0; 3 5.08,0; 4 7.62,0; 5 10.16,0; 6 12.7,0
1X02 = drill 1.016 long: 1 -1.27,0; 2 1.27,0
1X05 = drill 1.016 long: 1 -5.08,0; 2 -2.54,0; 3 0,0; 4 2.54,0; 5 5.08,0
R0603 = smd 1 x 1.1: 1 -0.85,0; 2 0.85,0
SOT95P280X145-6N = smd 1.27 x 0.559: 1 -1.295,0.94; 2 -1.295,0; 3 -1.295,-0.94; 4 1.295,-0.94; 5 1.295,0; 6 1.295,0.94
HDF15V = drill 0.9 octagon: 1 4.329,1.98 | drill 0.9: 2 2.043,1.98; 3 -0.243,1.98; 4 -2.529,1.98; 5 -4.815,1.98; 6 5.472,0; 7 3.186,0; 8 0.9,0; 9 -1.386,0; 10 -3.672,0; 11 4.329,-1.98; 12 2.043,-1.98; 13 -0.243,-1.98; 14 -2.529,-1.98; 15 -4.815,-1.98 | hole 3: -12.5,0; 12.5,0
MDIN06K = drill 0.9: 1 1,-2.7; 2 -1.3,-2.4; 3 2.8,-0.4; 4 -2.8,-0.4; 5 2.3,1.6; 6 -2.3,1.6 | drill 0.9 long: M1 -4.7,0; M2 4.7,0

### Placement (x,y rotation side)
C1  40.39,51.7 180 top
C2  45,50.1 90 top
C3  36.58,50.36 90 top
C4  74.77,38.61 90 top
C5  62.9,41.31 90 top
C6  44.4,38.11 270 top
C7  44.26,43.61 270 top
C9  8.5,16.1 0 bottom
C10  79.5,16.1 270 bottom
C11  86,49.6 180 top
C13  55.5,20.6 180 bottom
C14  69.5,21.6 180 bottom
C16  117,14.6 90 bottom
C17  79.5,48.6 270 top
CN1  63.5,5.87 0 top
CN2  63.5,28.45 0 top
IC1  40.69,49.1 270 top
IC5  70.16,40.81 0 top
IC6  87,42.6 0 top
J2  92.5,54.1 180 top
JP1  57.5,41.1 90 top
JP2  40.61,55.06 180 top
R1  40.81,43.49 180 top
R2  40.81,40.83 180 top
R3  47.5,36.6 180 top
R4  47.19,41.71 0 top
R5  19.15,36.41 90 bottom
R6  16.4,36.41 90 bottom
R7  13.65,36.41 90 bottom
R8  82.5,49.6 0 top
U1  47.5,44.6 180 top
U2  47.5,39.1 180 top
X1  17.46,44.99 0 top
X2  106.5,42.1 0 top

### Tracks (layer width: path | path; a pad name or v marks a point on that pad's centre or on a via)
!MCLR
  Top 0.254: IC6.4 85.73,39.87 85,40.6 78,40.6 77.5,41.1 77.5,53.1 78.5,54.1 J2.6
+3V3
  Top 0.2: R4.2 48.04,42.06 47.5,42.6 47.5,44.35 47.25,44.6 U1.5 | 48.15,41.6 48.15,41.5 47.5,40.85 47.5,39.35 47.25,39.1 | U2.5 47.25,39.1 | 47.25,39.1 47.5,38.85 47.5,37.45 R3.2
  Top 0.254: C7.1 46.06,44.46 U1.5 | C6.1 44.55,39.1 U2.5
  Top 0.406: IC5.4 70.02,44.1 64,44.1 63.26,43.36 C5.+ 62.24,43.36 61,44.6 55,44.6 54,43.6 54,42.6 53,41.6 48.15,41.6 R4.2
+12V
  Top 0.178: 33.62,32.35 CN2.P$138 33.5,32.35
  Top 0.2: CN1.P$136 34.46,7.14 33.75,7.85 33.75,9.58 CN1.P$138
  Bottom 0.178: CN1.P$138 33.5,9.85 33.5,25.85 32.75,26.6 32.75,28.6 33.5,29.35 33.5,32.1 33.62,32.23 CN2.P$138
  Bottom 0.2: 33.5,29.35 33.55,29.35 33.9,29.7 34.91,29.7 CN2.P$136
+12V_1
  Bottom 0.15: 8.5,9.85 CN1.P$178
  Bottom 0.178: CN2.P$178 8.5,32.1 8.5,29.35 9.25,28.6 9.25,26.85 8.5,26.1 8.5,9.85 8.38,9.73
_ACTIVE
  Bottom 0.178: CN1.P$126 41.5,9.85 41.5,26.1 42.25,26.85 42.25,28.6 41.5,29.35 41.5,32.1 CN2.P$126
_AS
  Bottom 0.178: CN1.P$91 62.75,2.1 62.5,2.35 62.5,6.1 61.75,6.85 61.75,8.35 62.75,9.35 62.75,24.6 CN2.P$91
_AVEC
  Bottom 0.178: CN1.P$96 60.5,7.35 60.5,23.35 61.25,24.1 61.25,26.1 60.5,26.85 60.5,29.6 CN2.P$96
_BEER
  Bottom 0.178: CN1.P$94 61.75,9.85 61.75,25.85 62.5,26.6 62.5,28.6 61.75,29.35 61.75,32.1 CN2.P$94
_BLANK
  Top 0.178: CN1.P$153 23.25,4.6 23.25,8.6 22.5,9.35 22.5,23.6 23.25,24.35 23.25,27.1 CN2.P$153
_CPU_BG
  Top 0.178: CN1.P$113 49,4.6 49.25,4.85 49.25,8.6 50,9.35 50,23.35 49,24.35 49,27.1 CN2.P$113
_CPU_BR
  Bottom 0.178: CN1.P$111 50,2.1 50,5.85 49.25,6.6 49.25,8.6 50,9.35 50,24.6 CN2.P$111
_CSYNC  (via drill 0.6)
  Top 0.178: 34.62,31.85 33.5,30.73 24.5,30.73 21,27.23 CN2.P$157
  Top 0.2: 34.62,31.85 34.62,33.23 35.12,33.23 v35.5,33.6 | v51.5,42.6 51.5,43.1 51,43.6 48.86,43.6 U1.1
  Bottom 0.178: CN1.P$157 20.75,4.6 20.75,8.6 20,9.35 20,23.6 20.75,24.35 20.75,27.1 CN2.P$157
  Bottom 0.2: v35.5,33.6 45,33.6 46,34.6 52,34.6 52.5,34.1 53.5,34.1 54,34.6 54,42.1 53.5,42.6 v51.5,42.6
_DKRD
  Top 0.178: CN1.P$129 38.5,4.6 38.5,8.6 37.75,9.35 37.75,23.6 38.5,24.35 38.5,27.1 CN2.P$129
_DKWD
  Bottom 0.178: CN1.P$130 38.5,9.85 38.5,26.1 37.75,26.85 37.75,28.6 38.5,29.35 38.5,32.1 CN2.P$130
_DS
  Top 0.178: CN1.P$92 63,7.35 63,23.35 64,24.35 64,25.85 63,26.85 63,29.6 CN2.P$92
_DSACK_0
  Bottom 0.178: CN1.P$98 59.25,9.85 59.25,26.1 60,26.85 60,28.6 59.25,29.35 59.25,32.1 CN2.P$98
_DSACK_1
  Top 0.178: CN1.P$97 59.25,4.6 59.25,8.6 60,9.35 60,23.6 59.25,24.35 59.25,27.1 CN2.P$97
_EXP_BG
  Top 0.178: CN1.P$112 50.25,7.35 50.5,7.6 50.5,23.6 51.25,24.35 51.25,25.85 50.25,26.85 50.25,29.6 CN2.P$112
_EXP_BR
  Bottom 0.178: CN1.P$114 49,9.85 49.25,10.1 49.25,26.1 50,26.85 50,28.6 49,29.6 49,32.1 CN2.P$114
_EXT_AUDIO
  Top 0.178: CN1.P$140 32.5,7.35 32.75,7.6 32.75,23.6 33.5,24.35 33.5,25.85 32.5,26.85 32.5,29.6 CN2.P$140
_EXT_VIDEO
  Bottom 0.178: 11,9.85 CN1.P$174 10.75,9.85 10.75,13.35 | CN2.P$174 11,32.1 11,29.35 11.75,28.6 11.75,26.85 11,26.1 11,24.35 11.25,24.1 11.25,18.6
  Bottom 0.2: 10.75,13.35 12.5,15.1 12.5,17.35 11.25,18.6
_FIRE0
  Bottom 0.178: CN1.P$123 42.75,2.1 42.75,5.85 43.5,6.6 43.5,8.6 42.75,9.35 42.75,24.6 CN2.P$123
_FIRE1
  Top 0.178: CN1.P$124 42.5,7.35 42.25,7.6 42.25,23.6 41.5,24.35 41.5,26.1 42.25,26.85 42.25,29.35 42.5,29.6 CN2.P$124
_HLT
  Bottom 0.178: CN1.P$86 66.5,9.85 66.5,25.85 65.75,26.6 65.75,28.6 66.5,29.35 66.5,32.1 CN2.P$86
_HSYNC  (via drill 0.6)
  Top 0.2: v49,47.1 49,45.75 U1.3
  Bottom 0.178: CN1.P$159 19.5,2.1 19.5,5.85 18.75,6.6 18.75,8.6 19.5,9.35 19.5,24.6 CN2.P$159 20,25.1 20,27.6 21,28.6 21,30.1 22,31.1 22,32.1
  Bottom 0.2: 22,32.1 22,38.1 26.5,42.6 26.5,47.1 27.25,47.85 31.5,47.85 31.75,47.6 48.5,47.6 v49,47.1
_INT2
  Bottom 0.178: CN1.P$119 45.25,2.1 45.25,5.85 46,6.6 46,8.6 45.25,9.35 45.25,24.6 CN2.P$119
_INT6
  Top 0.178: CN1.P$120 45,7.1 44.75,6.85 44.75,4.1 44.25,3.6 42.75,3.6 42.75,5.85 43.5,6.6 43.5,8.6 42.75,9.35 42.75,23.35 43.5,24.1 43.5,26.1 42.75,26.85 42.75,27.6 45,29.85 CN2.P$120
_KB_CLOCK  (via drill 0.5)
  Top 0.178: 44,27.1 44,24.35 44.75,23.6 44.75,9.1 44,8.35 44,4.6 CN1.P$121 | 44,27.1 46,29.1 46,29.6 v47.5,31.1 47.5,32.35 48.5,33.35 82.75,33.35 | 44,27.1 CN2.P$121
  Top 0.254: 82.75,33.35 84,33.35 84.5,33.85 84.5,37.77 IC6.3
  Bottom 0.178: v47.5,31.1 47.5,32.6
_KB_DATA  (via drill 0.5)
  Top 0.178: v46.5,33.85 82,33.85
  Top 0.254: 82,33.85 82.25,33.85 83.25,34.85 83.25,37.75 IC6.2
  Bottom 0.178: 44,31.35 44,32.1 CN2.P$122 44,32.6 | 44,31.35 44,29.35 44.75,28.6 44.75,26.6 44,25.85 44,9.85 CN1.P$122 | 44,31.35 v46.5,33.85
_LED
  Top 0.178: CN1.P$125 41.25,4.6 41,4.85 41,8.6 40.25,9.35 40.25,23.6 41,24.35 41,26.85 41.25,27.1 CN2.P$125
_MUTE
  Bottom 0.178: CN1.P$142 31,9.85 30.75,10.1 30.75,26.1 30,26.85 30,28.6 31,29.6 31,32.1 CN2.P$142
_NTSC
  Bottom 0.178: CN1.P$171 12.25,2.1 12.25,5.85 13,6.6 13,8.6 12.25,9.35 12.25,13.1 13,13.85 13,19.1 12.25,19.85 12.25,24.6 CN2.P$171
_PIXELSW
  Top 0.178: CN1.P$152 24.75,7.35 24.5,7.6 24.5,23.6 23.75,24.35 23.75,26.1 24.75,27.1 24.75,29.6 CN2.P$152
_PIXELSW_EXT
  Bottom 0.178: CN1.P$151 25,2.1 25,6.1 25.75,6.85 25.75,8.6 25,9.35 25,24.6 CN2.P$151
_PUNT
  Top 0.178: CN1.P$117 46.25,4.6 46,4.85 46,8.6 45.25,9.35 45.25,23.35 46,24.1 46,26.85 46.25,27.1 CN2.P$117
_RESET
  Bottom 0.178: CN1.P$118 46.25,9.85 46,10.1 46,26.1 45.25,26.85 45.25,28.6 46.25,29.6 46.25,32.1 CN2.P$118
_RMC
  Bottom 0.178: CN1.P$106 53.75,9.85 53.75,26.1 53,26.85 53,28.6 53.75,29.35 53.75,32.1 CN2.P$106
_RST
  Top 0.178: CN1.P$85 66.75,4.6 67,4.85 67,8.6 67.75,9.35 67.75,26.1 66.75,27.1 CN2.P$85
_RXD  (via drill 0.5, 0.6)
  Top 0.178: 40.25,27.6 40.25,24.85 CN2.P$127 | 39,29.35 39,30.1 39.75,30.85 39.75,33.85
  Top 0.2: IC1.5 37.75,48.1 | 37.75,48.1 35.5,48.1 35,48.6 35,53.1 35.5,53.6 35.5,55.03 JP2.5 | 39.75,33.85 39.75,34.35 38.25,35.85 v38.25,39.6 | 39,29.35 39,28.85 40.25,27.6 | v38.25,46.35 37.75,46.85 37.75,48.1
  Bottom 0.178: CN1.P$127 40.25,2.1 40.25,6.1 41,6.85 41,8.6 40.25,9.35 40.25,24.6 CN2.P$127
  Bottom 0.2: v38.25,39.6 v38.25,46.35
_TXD  (via drill 0.5, 0.6)
  Top 0.2: JP2.4 38.07,53.17 37.5,52.6 36,52.6 35.5,52.1 35.5,49.1 36,48.6 38.25,48.6 | 38.25,48.6 IC1.4 | CN2.P$128 40.01,30.11 40.25,30.35 40.25,35.1 39,36.35 v39,37.85 | v39.75,46.1 39.75,48.35 39.5,48.6 IC1.4 | IC1.4 38.25,48.6
  Bottom 0.178: CN1.P$128 40,7.35 39.75,7.6 39.75,23.6 39,24.35 39,26.1 40,27.1 40,29.6 CN2.P$128
  Bottom 0.2: v39,37.85 39,45.35 v39.75,46.1
_VSYNC  (via drill 0.5, 0.6)
  Top 0.178: CN1.P$160 19.5,7.35 19.5,23.35 18.75,24.1 18.75,26.1 19.5,26.85 19.5,29.6 CN2.P$160 19.75,29.85 19.75,32.35 20.75,33.35 24.25,33.35
  Top 0.2: 24.25,33.35 25,33.35 v26.05,34.65 | U2.3 52.56,40.04 53,39.6 v53,35.1
  Bottom 0.2: v53,35.1 45.5,35.1 45,34.6 34.5,34.6 v26.05,34.65
_XCLKEN
  Top 0.178: CN1.P$172 12,7.35 11.75,7.6 11.75,23.6 11,24.35 11,26.1 12,27.1 12,29.6 CN2.P$172
A0
  Bottom 0.178: CN1.P$38 99.5,9.85 99.5,26.1 98.75,26.85 98.75,28.6 99.5,29.35 99.5,32.1 CN2.P$38
A1
  Bottom 0.178: CN1.P$37 99.75,4.6 100,4.85 100,8.6 100.75,9.35 100.75,23.35 100,24.1 100,26.85 99.75,27.1 CN2.P$37
A2
  Top 0.178: CN1.P$36 101,7.35 101.25,7.6 101.25,23.6 102,24.35 102,26.1 101,27.1 101,29.6 CN2.P$36
A3
  Top 0.178: CN1.P$35 100.75,2.1 100.75,5.85 100,6.6 100,8.6 100.75,9.35 100.75,24.6 CN2.P$35
A4
  Bottom 0.178: CN1.P$34 102,9.85 102,26.1 101.25,26.85 101.25,28.6 102,29.35 102,32.1 CN2.P$34
A5
  Top 0.178: CN1.P$33 102.25,4.6 102.5,4.85 102.5,8.6 103.25,9.35 103.25,23.6 102.5,24.35 102.5,26.85 102.25,27.1 CN2.P$33
A6
  Top 0.178: CN1.P$32 103.75,7.35 103.75,23.6 104.5,24.35 104.5,26.1 103.75,26.85 103.75,29.6 CN2.P$32
A7
  Bottom 0.178: CN1.P$31 103.75,2.1 103.75,6.1 104.5,6.85 104.5,8.6 103.75,9.35 103.75,24.6 CN2.P$31
A8
  Top 0.178: CN1.P$28 106.25,7.35 106.25,23.35 107,24.1 107,26.1 106.25,26.85 106.25,29.6 CN2.P$28
A9
  Bottom 0.178: CN1.P$27 106.25,2.1 106.25,5.85 107,6.6 107,8.6 106.25,9.35 106.25,24.6 CN2.P$27
A10
  Bottom 0.178: CN1.P$26 107.25,9.85 107,10.1 107,26.1 106.25,26.85 106.25,28.6 107.25,29.6 107.25,32.1 CN2.P$26
A11
  Bottom 0.178: CN1.P$25 107.5,4.6 107.5,8.35 108.25,9.1 108.25,23.6 107.5,24.35 107.5,27.1 CN2.P$25
A12
  Top 0.178: CN1.P$24 108.5,7.35 108.25,7.6 108.25,23.6 107.5,24.35 107.5,25.85 108.5,26.85 108.5,29.6 CN2.P$24
A13
  Bottom 0.178: CN1.P$23 108.75,2.1 108.75,5.85 109.5,6.6 109.5,8.6 108.75,9.35 108.75,24.6 CN2.P$23
A14
  Bottom 0.178: CN1.P$22 109.75,9.85 109.5,10.1 109.5,26.1 108.75,26.85 108.75,28.6 109.75,29.6 109.75,32.1 CN2.P$22
A15
  Top 0.178: CN1.P$21 109.75,4.6 109.5,4.85 109.5,8.6 108.75,9.35 108.75,23.35 109.75,24.35 109.75,27.1 CN2.P$21
A16
  Top 0.178: CN1.P$18 112.5,9.85 112.75,10.1 112.75,26.1 113.5,26.85 113.5,28.6 112.5,29.6 112.5,32.1 CN2.P$18
A17
  Bottom 0.178: CN1.P$17 112.25,4.6 112.25,8.35 111.25,9.35 111.25,23.35 112.25,24.35 112.25,27.1 CN2.P$17
A18
  Bottom 0.178: CN1.P$16 113.75,7.35 114,7.6 114,23.6 114.75,24.35 114.75,25.85 114,26.6 114,29.35 113.75,29.6 CN2.P$16
A19
  Bottom 0.178: CN1.P$15 113.5,2.1 113.5,5.85 112.75,6.6 112.75,8.6 113.5,9.35 113.5,24.6 CN2.P$15
A20
  Bottom 0.178: CN1.P$14 115,9.85 115.25,10.1 115.25,26.1 116,26.85 116,28.6 115,29.6 115,32.1 CN2.P$14
A21
  Top 0.178: CN1.P$13 114.75,4.6 114.75,8.35 114,9.1 114,23.6 114.75,24.35 114.75,27.1 CN2.P$13
A22
  Top 0.178: CN1.P$12 116,7.35 116,23.35 115.25,24.1 115.25,26.1 116,26.85 116,29.6 CN2.P$12
A23
  Bottom 0.178: CN1.P$11 116,2.1 116,5.85 115.25,6.6 115.25,8.6 116,9.35 116,24.6 CN2.P$11
A24
  Bottom 0.178: CN1.P$8 118.5,7.35 118.5,23.6 117.75,24.35 117.75,26.1 118.5,26.85 118.5,29.6 CN2.P$8
A25
  Top 0.178: CN1.P$7 118.5,2.1 118.5,6.1 117.75,6.85 117.75,8.6 118.5,9.35 118.5,24.6 CN2.P$7
A26
  Bottom 0.178: CN1.P$6 120.25,9.85 120.25,26.1 121,26.85 121,28.6 120.25,29.35 120.25,32.1 CN2.P$6
A27
  Top 0.178: CN1.P$5 120.25,4.6 120.25,8.6 121,9.35 121,23.6 120.25,24.35 120.25,27.1 CN2.P$5
A28
  Bottom 0.178: CN1.P$4 121.5,7.35 123.5,9.35 123.5,27.6 121.5,29.6 CN2.P$4
A29
  Bottom 0.178: CN1.P$3 121.25,2.1 121,2.35 121,6.1 120.25,6.85 120.25,8.6 121.25,9.6 121.25,24.6 CN2.P$3
A30
  Top 0.178: CN1.P$2 122.75,9.85 123.5,10.6 123.5,31.35 122.75,32.1 CN2.P$2
A31
  Top 0.178: CN1.P$1 122.5,4.6 122.25,4.85 122.25,8.6 121.5,9.35 121.5,23.35 122.5,24.35 122.5,27.1 CN2.P$1
AB
  Top 0.178: CN1.P$168 14.5,7.35 14.25,7.6 14.25,23.6 13.5,24.35 13.5,25.85 14.5,26.85 14.5,29.6 CN2.P$168
  Bottom 0.178: CN2.P$168 14.5,30.1 14.5,32.6 13.75,33.35
  Bottom 0.2: 13.75,33.35 13.75,35.46 R7.1
AB_EXT
  Bottom 0.178: CN1.P$167 14.5,2.1 14.25,2.35 14.25,6.1 13.5,6.85 13.5,8.35 14.5,9.35 14.5,24.6 CN2.P$167
AG
  Bottom 0.178: CN1.P$166 16,9.85 16,25.85 17,26.85 17,28.35 16,29.35 16,32.1 CN2.P$166 16,32.6 16.38,32.98
  Bottom 0.2: 16.38,32.98 16.38,35.54 R6.1
AG_EXT
  Top 0.178: CN1.P$165 16,4.6 16,7.85 17,8.85 17,23.35 16,24.35 16,27.1 CN2.P$165
AGND
  Top 0.178: CN1.P$177 8,4.85 8,8.6 7.25,9.35 7.25,23.6 8,24.35 8,26.85 8.25,27.1 CN2.P$177
AR
  Top 0.178: CN1.P$164 17,7.1 17,4.35 16.25,3.6 9.25,3.6 9.25,5.6 8.5,6.35 8.5,8.1 9.25,8.85 9.25,23.6 8.5,24.35 8.5,26.1 9.75,27.35 9.75,28.6 11,29.85 11,30.1 11.75,30.85 17,30.85 17,29.85 CN2.P$164
  Bottom 0.178: 17.5,32.85 17.5,30.1 CN2.P$164
  Bottom 0.2: 17.5,32.85 17.75,32.85 19,34.1 19,35.41 R5.1
AR_EXT
  Bottom 0.178: CN1.P$163 17.25,2.1 17.5,2.35 17.5,6.1 18.25,6.85 18.25,8.35 17.25,9.35 17.25,24.6 CN2.P$163
BLUE
  Bottom 0.2: R7.2 13.65,39.25 16,41.6 16,43.1 17.25,44.35 17.25,46.94 X1.3
CCK_B
  Top 0.178: CN1.P$158 20.75,9.85 20.75,26.1 20,26.85 20,28.6 20.75,29.35 20.75,32.1 CN2.P$158
CPUCLK_A
  Top 0.178: CN1.P$99 58,2.1 58,5.85 58.75,6.6 58.75,8.6 58,9.35 58,24.6 CN2.P$99
D0
  Bottom 0.178: CN1.P$78 74.5,9.85 74.5,26.1 75.25,26.85 75.25,28.6 74.5,29.35 74.5,32.1 CN2.P$78
D1
  Bottom 0.178: CN1.P$77 74.25,4.6 74,4.85 74,8.6 73.25,9.35 73.25,23.35 74,24.1 74,26.85 74.25,27.1 CN2.P$77
D2
  Top 0.178: CN1.P$76 75.5,7.35 75.25,7.6 75.25,23.6 74.5,24.35 74.5,26.1 75.5,27.1 75.5,29.6 CN2.P$76
D3
  Bottom 0.178: CN1.P$75 75.75,2.1 75.75,5.85 76.5,6.6 76.5,8.6 75.75,9.35 75.75,24.6 CN2.P$75
D4
  Bottom 0.178: CN1.P$74 77,9.85 77,25.85 77.75,26.6 77.75,28.6 77,29.35 77,32.1 CN2.P$74
D5
  Top 0.178: CN1.P$73 77,4.6 77,8.35 77.75,9.1 77.75,23.6 77,24.35 77,27.1 CN2.P$73
D6
  Top 0.178: CN1.P$72 78.25,7.1 78.25,4.35 79,3.6 85.5,3.6 85.5,5.85 84.75,6.6 84.75,8.6 85.5,9.35 85.5,23.35 84.75,24.1 84.75,26.1 85.5,26.85 85.5,27.6 84.5,28.6 78.25,28.6 78.25,29.6 CN2.P$72
D7
  Bottom 0.178: CN1.P$71 78,2.1 77.75,2.35 77.75,6.1 77,6.85 77,8.35 78,9.35 78,24.6 CN2.P$71
D8
  Top 0.178: CN1.P$68 80.75,7.35 81,7.6 81,23.6 81.75,24.35 81.75,25.85 80.5,27.1 80.5,27.35 79.75,28.1 77,28.1 77,30.1 77.75,30.85 80.5,30.85 80.5,29.85 CN2.P$68
D9
  Bottom 0.178: CN1.P$67 80.75,2.1 81,2.35 81,6.1 81.75,6.85 81.75,8.35 80.75,9.35 80.75,24.6 CN2.P$67
D10
  Bottom 0.178: CN1.P$66 81.75,9.85 81.75,25.85 81,26.6 81,28.6 81.75,29.35 81.75,32.1 CN2.P$66
D11
  Top 0.178: CN1.P$65 82,4.6 82.25,4.85 82.25,8.6 83,9.35 83,23.35 82.25,24.1 82.25,26.85 82,27.1 CN2.P$65
D12
  Bottom 0.178: CN1.P$64 83.25,7.35 83.5,7.6 83.5,23.6 84.25,24.35 84.25,26.1 83.25,27.1 83.25,29.6 CN2.P$64
D13
  Bottom 0.178: CN1.P$63 83,2.1 83,5.85 82.25,6.6 82.25,8.6 83,9.35 83,24.6 CN2.P$63
D14
  Bottom 0.178: CN1.P$62 84.5,9.85 84.75,10.1 84.75,26.1 85.5,26.85 85.5,28.6 84.5,29.6 84.5,32.1 CN2.P$62
D15
  Top 0.178: CN1.P$61 84.25,4.6 84.25,8.6 83.5,9.35 83.5,23.6 84.25,24.35 84.25,27.1 CN2.P$61
D16
  Bottom 0.178: CN1.P$58 86.75,9.85 86.75,26.1 86,26.85 86,28.6 86.75,29.35 86.75,32.1 CN2.P$58
D17
  Top 0.178: CN1.P$57 87.25,4.85 87.25,8.6 88,9.35 88,23.6 87.25,24.35 87.25,26.85 87,27.1 CN2.P$57
D18
  Bottom 0.178: CN1.P$56 88.5,7.35 88.5,23.6 89.25,24.35 89.25,26.1 88.5,26.85 88.5,29.6 CN2.P$56
D19
  Top 0.178: CN1.P$55 88.5,2.1 88.5,6.1 89.25,6.85 89.25,8.6 88.5,9.35 88.5,24.6 CN2.P$55
D20
  Bottom 0.178: CN1.P$54 89.75,9.85 89.75,26.1 90.5,26.85 90.5,28.6 89.75,29.35 89.75,32.1 CN2.P$54
D21
  Top 0.178: CN1.P$53 89.75,4.6 89.75,8.6 90.5,9.35 90.5,23.6 89.75,24.35 89.75,27.1 CN2.P$53
D22
  Top 0.178: CN1.P$52 91,7.35 91,23.35 91.75,24.1 91.75,26.1 91,26.85 91,29.6 CN2.P$52
D23
  Bottom 0.178: CN1.P$51 91,2.1 91,5.85 91.75,6.6 91.75,8.6 91,9.35 91,24.6 CN2.P$51
D24
  Bottom 0.178: CN1.P$48 93.25,7.35 93,7.6 93,23.6 92.25,24.35 92.25,25.85 93.25,26.85 93.25,29.6 CN2.P$48
D25
  Bottom 0.178: CN1.P$47 93.5,2.1 93.5,5.85 94.25,6.6 94.25,8.6 93.5,9.35 93.5,24.6 CN2.P$47
D26
  Bottom 0.178: CN1.P$46 94.75,9.85 94.75,25.85 95.75,26.85 95.75,28.35 94.75,29.35 94.75,32.1 CN2.P$46
D27
  Top 0.178: CN1.P$45 94.5,4.6 94.25,4.85 94.25,8.6 93.5,9.35 93.5,23.35 94.5,24.35 94.5,27.1 CN2.P$45
D28
  Top 0.178: CN1.P$44 96,7.35 96.25,7.6 96.25,23.6 97,24.35 97,25.85 96,26.85 96,29.6 CN2.P$44
D29
  Bottom 0.178: CN1.P$43 96,2.1 96.25,2.35 96.25,6.1 97,6.85 97,8.35 96,9.35 96,24.6 CN2.P$43
D30
  Bottom 0.178: CN1.P$42 97,9.85 97,25.85 96.25,26.6 96.25,28.6 97,29.35 97,32.1 CN2.P$42
D31  (via drill 0.5)
  Top 0.178: v98.75,22.1 98.75,9.35 99.5,8.6 99.5,6.85 97.25,4.6 CN1.P$41
  Bottom 0.2: v98.75,22.1 98.75,22.35 97.5,23.6 97.5,26.83 CN2.P$41
DB
  Top 0.178: CN1.P$149 26,4.6 25.75,4.85 25.75,8.6 25,9.35 25,23.6 25.75,24.35 25.75,26.85 26,27.1 CN2.P$149
DG
  Top 0.178: CN1.P$148 27.25,7.35 27,7.6 27,23.6 26.25,24.35 26.25,26.1 27.25,27.1 27.25,29.6 CN2.P$148
DI
  Bottom 0.178: CN1.P$150 26.25,9.85 26.25,26.1 27,26.85 27,28.6 26.25,29.35 26.25,32.1 CN2.P$150
DKWE
  Top 0.178: CN1.P$132 37.25,7.35 37.25,23.35 36.5,24.1 36.5,26.1 37.25,26.85 37.25,29.6 CN2.P$132
DR
  Bottom 0.178: CN1.P$147 27.5,2.1 27.5,5.85 28.25,6.6 28.25,8.6 27.5,9.35 27.5,24.6 CN2.P$147
FC0
  Top 0.178: CN1.P$105 53.75,4.6 53.75,8.6 53,9.35 53,23.6 53.75,24.35 53.75,27.1 CN2.P$105
FC1
  Top 0.178: CN1.P$104 55,7.35 55,23.6 54.25,24.35 54.25,26.1 55,26.85 55,29.6 CN2.P$104
FC2
  Bottom 0.178: CN1.P$103 55.25,2.1 55.5,2.35 55.5,6.1 56.25,6.85 56.25,8.6 55.5,9.35 55.5,24.35 55.25,24.6 CN2.P$103
GND  (via drill 0.5, 0.6)
  Top 0.2: IC1.10 43.5,50.1 44.25,50.85 44.9,50.85 C2.2 45,52.6 44.5,53.1 41.5,53.1 40.61,53.99 JP2.3 40.5,54.95 40.5,53.6 40,53.1 39,53.1 37.11,51.21 C3.2 | IC5.1 68,37.8 68,39.1 68.35,39.46 C4.2 74.77,40.87 v75,41.1 | C7.2 43.15,42.76 v43,42.6 | v80,52.1 79,52.1 78.5,51.6 78.5,48.6 79.35,47.75 C17.2 v79.5,46.1 | C11.2 85.15,50.75 v85.25,50.85 | v87,36.1 IC6.5 | v111,28.1 109.75,29.35 109.75,30.85 109.5,31.1 106.5,31.1 106,31.6
  Top 0.254: C6.2 44.56,37.1 44.5,37.04 v44.5,35.6 | U2.2 v50.5,39.1 | U1.2 v51,44.6 | 58.07,39.26 57.84,39.26 57.5,39.6 57.5,38.85 57.75,38.6 v57.75,37.35 | v57.75,31.35 56.5,30.1 56.5,27.19 CN2.P$101 56.52,22.12 v56.5,22.1
  Top 0.305: X2.3 109.3,36.4 106,33.1 106,31.6 104.75,30.35 104.75,27.2 CN2.P$29
  Top 0.406: IC5.1 64.51,37.66 C5.- 58.07,39.26 JP1.1
  Bottom 0.2: v51,44.6 59,44.6 59,43.6 59.5,43.1 59.5,40.1 59,39.6 57.73,39.6 JP1.1 | v43,42.6 43,42.1 | CN2.P$49 92,27.25 92,30.35 90.75,31.6 90.75,34.35 90,35.1 87.5,35.1 87,35.6 v87,36.1 87,49.1 v85.25,50.85 85.25,52.35 85,52.6 | v80,52.1 84.5,52.1 85,52.6 | 85,52.6 85,53.98 J2.4 | v75,41.1 79,41.1 79.5,41.6 v79.5,46.1 | CN2.P$19 111.12,27.98 v111,28.1 | 117.25,23.85 117.25,27.1 117.5,27.35 117.5,30.85 118.5,31.85 118.5,36.35 115.25,39.6 110.3,39.6 109.3,40.6 X2.3
  Bottom 0.254: v50.5,39.1 51.5,39.1 | v57.75,37.35 v57.75,31.35 | v56.5,22.1 56.5,20.75 C13.2 | C14.2 72,21.6 72.5,22.1 72.5,24.11 CN2.P$79 | CN2.P$175 9.53,20.1 | 9.53,20.1 9.53,17.13 C9.- | 9.43,19.75 9.53,20.1 | CN1.P$175 9.53,1.58 10,1.1 22,1.1 22.5,1.6 22.5,1.78 CN1.P$155 22.23,1.88 23,1.1 28,1.1 28.5,1.6 28.5,4.52 CN1.P$145 28.57,4.68 29.5,5.6 33.5,5.6 33.75,5.35 | 33.75,5.35 33.75,4.69 CN1.P$137 | 33.75,5.35 34,5.6 35.75,5.6 36.2,5.16 CN1.P$133 36.2,3.33 CN1.P$131 CN1.P$135
  Bottom 0.305: C10.- 79.38,18.15 CN2.P$69 | C16.2 117,23.6 117.25,23.85 117.25,26.95 CN2.P$9 | v44.5,35.6 44,35.6 43,36.6 43,42.1
  pour Bottom: 0.5,59.1 126.5,59.1 126.5,0.6 0.5,0.6
GREEN
  Bottom 0.2: R6.2 16.4,39.75 18.25,41.6 18.25,43.1 19.5,44.35 X1.2
HSYNC_3V3
  Top 0.2: X1.13 17.22,43.07 18.1,43.95 25.4,43.95 27.75,41.6 33.25,41.6 35.25,43.6 39.85,43.6 R1.2
IPL0
  Top 0.178: CN1.P$83 70.5,2.1 70.75,2.35 70.75,6.1 71.5,6.85 71.5,8.6 70.5,9.6 70.5,24.6 CN2.P$83
IPL1
  Top 0.178: CN1.P$82 71.75,9.85 71.5,10.1 71.5,26.1 70.75,26.85 70.75,28.6 71.75,29.6 71.75,32.1 CN2.P$82
IPL2
  Top 0.178: CN1.P$81 72,4.6 72,8.6 72.75,9.35 72.75,23.6 72,24.35 72,27.1 CN2.P$81
LEFT
  Bottom 0.178: 6.75,23.6 6,24.35 6,26.1 6.75,26.85 6.75,29.6 CN2.P$180 | 6.75,7.35 CN1.P$180
  Bottom 0.2: 6.75,23.6 7.5,23.6 8,23.1 8,12.1 7,11.1 7,7.15
  Bottom 0.254: 7,7.15 CN1.P$180
LEFT_EXT
  Top 0.178: CN1.P$179 6.75,2.1 6.75,6.1 6,6.85 6,8.6 6.75,9.35 6.75,24.6 CN2.P$179
N$1
  Top 0.2: C1.1 41.24,50.36 42,49.6 IC1.9
N$2
  Top 0.2: C1.2 39.54,50.14 39,49.6 IC1.2
N$3
  Top 0.2: IC1.8 44.85,49.1 C2.1
N$6
  Top 0.2: R3.1 49.75,36.6 50,36.85 50,38.1 49.9,38.2 48.84,38.2 U2.1
N$7  (via drill 0.5)
  Top 0.2: U1.6 46.2,41.84 R4.1 | U2.6 41.69,38.16 40.75,39.1 40.75,41.35 41.25,41.85 46.2,41.85 R4.1 | R4.1 45.6,41.71 v45,41.1 | v52.25,40.85 v55.5,40.85
  Bottom 0.2: JP1.2 55.98,40.85 v55.5,40.85 | v45,41.1 52,41.1 v52.25,40.85
N$8
  Top 0.254: R1.1 41.89,43.49 43,45.6 46.14,45.6 U1.4
N$9
  Top 0.254: R2.1 42.45,40.04 U2.4
N$10
  Top 0.254: C17.1 79.65,49.6 R8.1 81.65,48.95 82,48.6 84,48.6 84.5,48.1 84.5,47.43 IC6.16
NC@1
  Top 0.178: 70.25,27.85 69.5,27.1 69.5,8.1 70.25,7.35 CN1.P$84
PC_KEYB_CLK
  Top 0.254: IC6.7 89.54,43.14 90.5,44.1 93,44.1 96.5,47.6 107.25,47.6 108.75,46.1 108.75,43.75 X2.5
PC_KEYB_DATA
  Top 0.254: X2.1 107.5,36.6 107,36.1 89,36.1 88.25,36.85 88.25,37.79 IC6.6
PGC
  Top 0.254: J2.2 89.54,53.68 IC6.12
PGD
  Top 0.254: J2.3 88.27,53.25 IC6.13
PIXELCLK
  Bottom 0.178: CN1.P$154 23.25,9.85 23.25,26.1 22.5,26.85 22.5,28.6 23.25,29.35 23.25,32.1 CN2.P$154
R_W
  Top 0.178: CN1.P$93 61.75,4.6 61.75,8.35 62.5,9.1 62.5,23.6 61.75,24.35 61.75,27.1 CN2.P$93
RED
  Bottom 0.2: R5.2 19.15,40.25 20.75,41.85 20.75,43.6 21.75,44.6 21.75,46.94 X1.1
RIGHT  (via drill 0.6)
  Top 0.254: v4,10.1 3,10.1 3,25.6 2.5,26.1 2.5,31.6 3,32.1 5.56,32.1 CN2.P$182
  Bottom 0.15: 5.5,9.85 CN1.P$182
  Bottom 0.178: 5.5,32.1 CN2.P$182
  Bottom 0.254: 5.5,9.85 4.25,9.85 v4,10.1
RIGHT_EXT
  Top 0.178: CN1.P$181 5.5,4.6 5,5.1 5,9.1 4.75,9.35 4.75,26.35 5.5,27.1 CN2.P$181
RS232_RX
  Top 0.2: IC1.6 43.5,48.1 44,47.1 47,47.1 47.5,47.6 47.5,56.6 47,57.1 43.5,57.1 43,56.6 43,55.21 JP2.2
RS232_TX
  Top 0.2: IC1.7 44,48.6 44.5,48.1 46,48.1 46.5,48.6 46.5,54.25 JP2.1
SIZ0
  Top 0.178: CN1.P$88 65.5,7.35 65.75,7.6 65.75,23.6 66.5,24.35 66.5,25.85 65.5,26.85 65.5,29.6 CN2.P$88
SIZ1
  Bottom 0.178: CN1.P$87 65.25,2.1 65.25,5.85 64.5,6.6 64.5,8.6 65.25,9.35 65.25,24.6 CN2.P$87
VCC  (via drill 0.5, 0.6)  (1 unrouted)
  Top 0.178: v6,23.48 6,26.1 7.25,27.35 7.25,27.48 9.5,29.73 CN2.P$176 | 79.5,9.6 CN1.P$70 79.5,9.6 | 28.5,32.35 CN2.P$146 28.5,32.35
  Top 0.2: v6,12.6 6,11.1 | IC1.1 37.5,50.1 37,49.6 36.67,49.6 C3.1 36.99,49.1 IC1.3 39.5,49.1 | IC5.3 74.67,37.66 C4.1
  Top 0.254: IC6.14 87,49.45 C11.1 87,49.75 87,51.6 86.5,52.1 84,52.1 83.5,51.6 | J2.5 82.34,52.76 83.5,51.6 | 83.5,50.1 83.5,49.75 R8.2 83.35,49.95 83.5,50.1 | 83.5,50.1 83.5,51.6 | CN2.P$30 103.43,33.6 92.5,33.6 92.08,33.18 CN2.P$50 92.08,33.03 91.5,33.6 86.5,33.6 85.75,32.85 85.75,30.6 | 85.75,30.6 85.75,29.74 CN2.P$60 | 85.75,30.6 85.25,31.1 81.5,31.1 80.34,32.26 CN2.P$70 78.41,32.26 77,30.85 73.5,30.85 73,30.35 73,29.74 CN2.P$80 | 74.92,37.6 C4.1 | CN1.P$146 28.57,6.18 27.5,5.1 27.5,4.1 26.5,3.1 23,3.1 22.25,3.85 22.25,7.11 CN1.P$156
  Bottom 0.178: v6,23.48 6,18.1 C9.+ | 98.38,29.73 CN2.P$40 | C13.1 54.5,20.6 54.5,24.1 54.25,24.35 54.25,26.1 55.5,27.35 55.5,28.6 56.5,29.6 56.5,32.1 CN2.P$102 56.75,32.35 57.25,32.85
  Bottom 0.2: CN1.P$70 79.38,13.93 C10.+ | C14.1 68.65,26.25 71,28.6 71.91,28.6 CN2.P$80 | C9.+ 6.45,13.15 6.5,13.1 v6,12.6 | X2.4 103.7,38.9 104.75,37.85 104.75,32.28 CN2.P$30
  Bottom 0.254: C16.1 117,10.15 CN1.P$10 | CN2.P$30 104.78,32.38 106,33.6 110.5,33.6 111,33.1 | 111,33.1 111,29.84 CN2.P$20 | CN2.P$10 117.47,33.13 117,33.6 111.5,33.6 111,33.1 | CN1.P$176 9.53,7.13 8,5.6 6,5.6 5.5,6.1 5.5,8.1 3.5,8.1 2.5,9.1 2.5,12.6 v6,12.6
  pour Top: 0.5,58.6 126.5,58.6 126.5,0.6 0.5,0.6
VGND  (via drill 0.5)
  Top 0.178: CN1.P$162 18.5,9.6 18.62,9.48 18.62,4.48 18.5,4.35 v18.5,3.48 17,3.48 v16.88,3.35 | v14.88,5.48 13.38,6.98 13.38,9.6 CN1.P$170
  Bottom 0.178: 14.25,27.23 14.25,28.6 13.5,29.35 13.5,32.1 CN2.P$170 | 14.25,27.23 14.25,26.6 13.5,25.85 13.5,9.85 13.38,9.73 CN1.P$170 | v18.5,3.48 18.5,4.48 CN1.P$161 | 14.25,27.23 13.38,27.23 CN2.P$169 | v16.88,3.35 15.75,3.35 14.88,4.23 v14.88,5.48
VGND@1
  Top 0.178: 18.25,8.35 17.5,9.1 17.5,23.6 18.25,24.35 18.25,27.1 CN2.P$161
VGND@2
  Bottom 0.178: 18.25,25.85 17.5,26.6 17.5,28.6 18.25,29.35 18.25,32.1 CN2.P$162
VGND@3
  Top 0.178: 13,24.1 12.25,23.35 12.25,9.35 13,8.6 13,4.85 13.25,4.6 CN1.P$169
VSYNC_3V3
  Top 0.2: X1.14 14.93,42.17 15.5,41.6 25.5,41.6 26.5,40.6 34.25,40.6 34.5,40.85 39.94,40.85 R2.2
XCLK
  Top 0.178: CN1.P$173 10.75,4.6 10.5,4.85 10.5,8.6 9.75,9.35 9.75,23.35 10.5,24.1 10.5,26.85 10.75,27.1 CN2.P$173

### Text on the board
bPlace: Design updated by Ian Stedman
bNames: Terrible Fire CD32 Adaptor / (C) 2017 S.J Leary / Publushed Under the GNU GPLv2